# EasyEDA Pro project ProDocument_LN_CTRL_V1_2026-03-25.epro, board PCB1
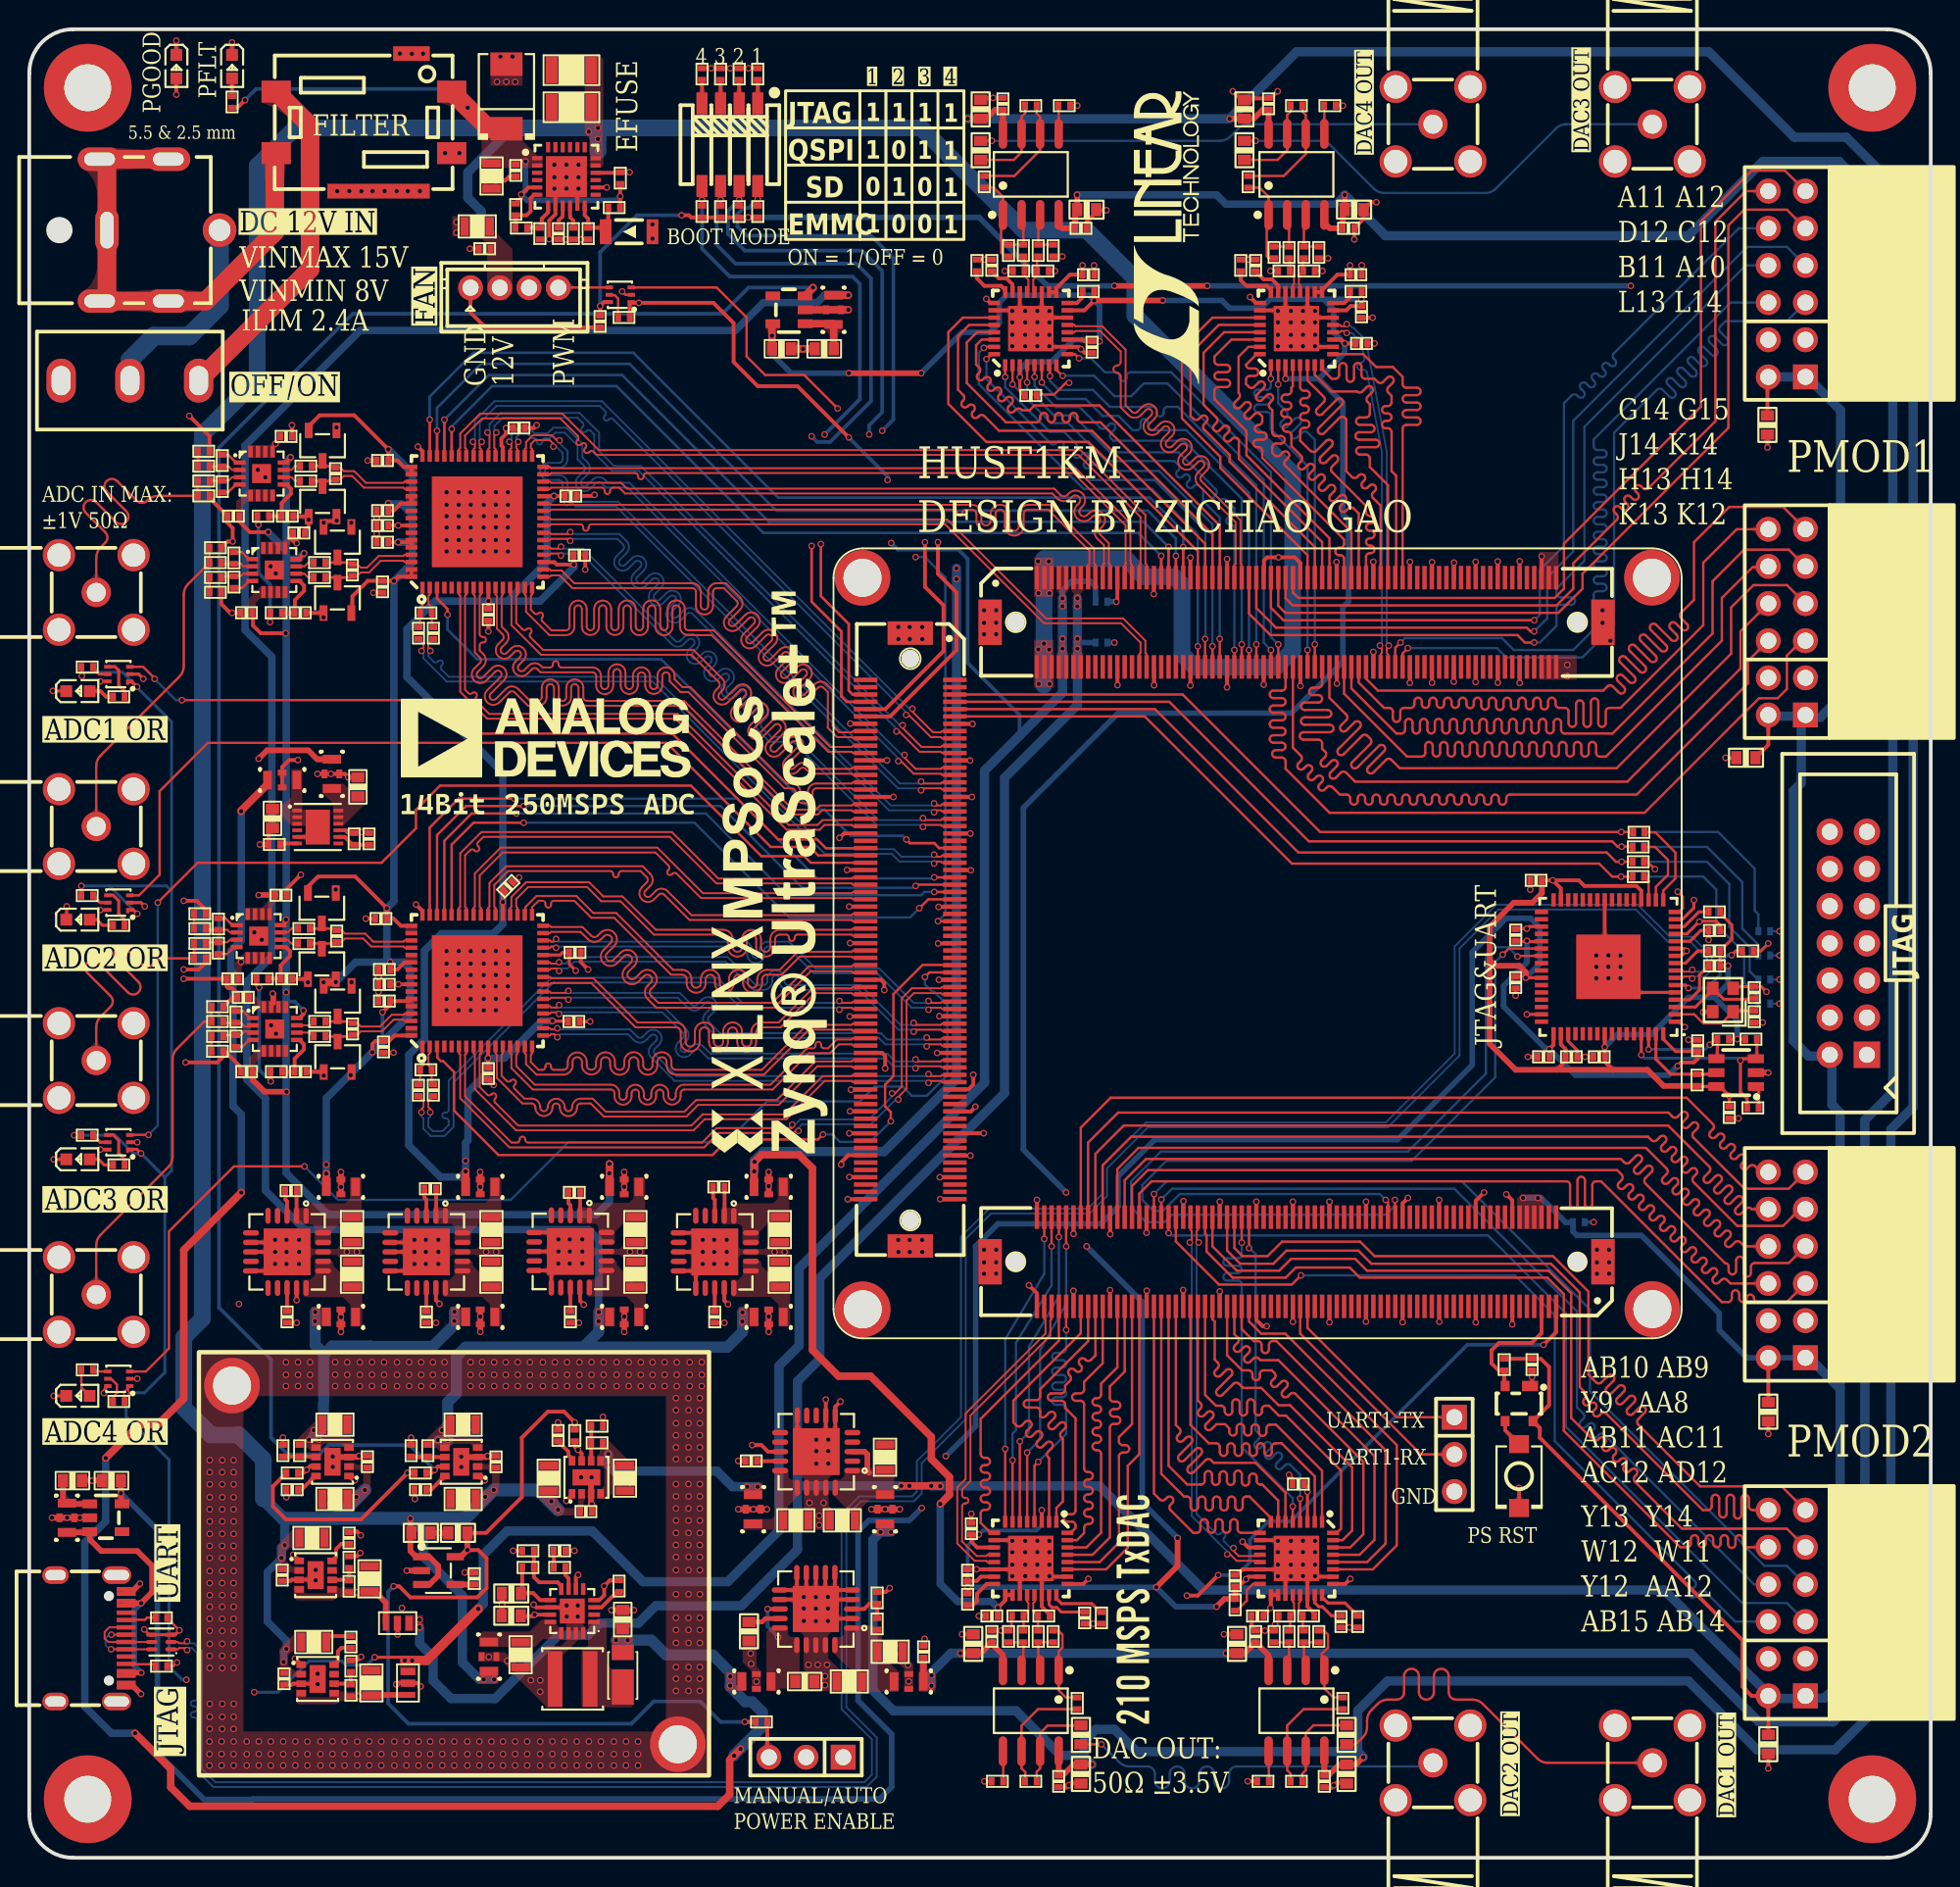
[diagram p5: board, top side]
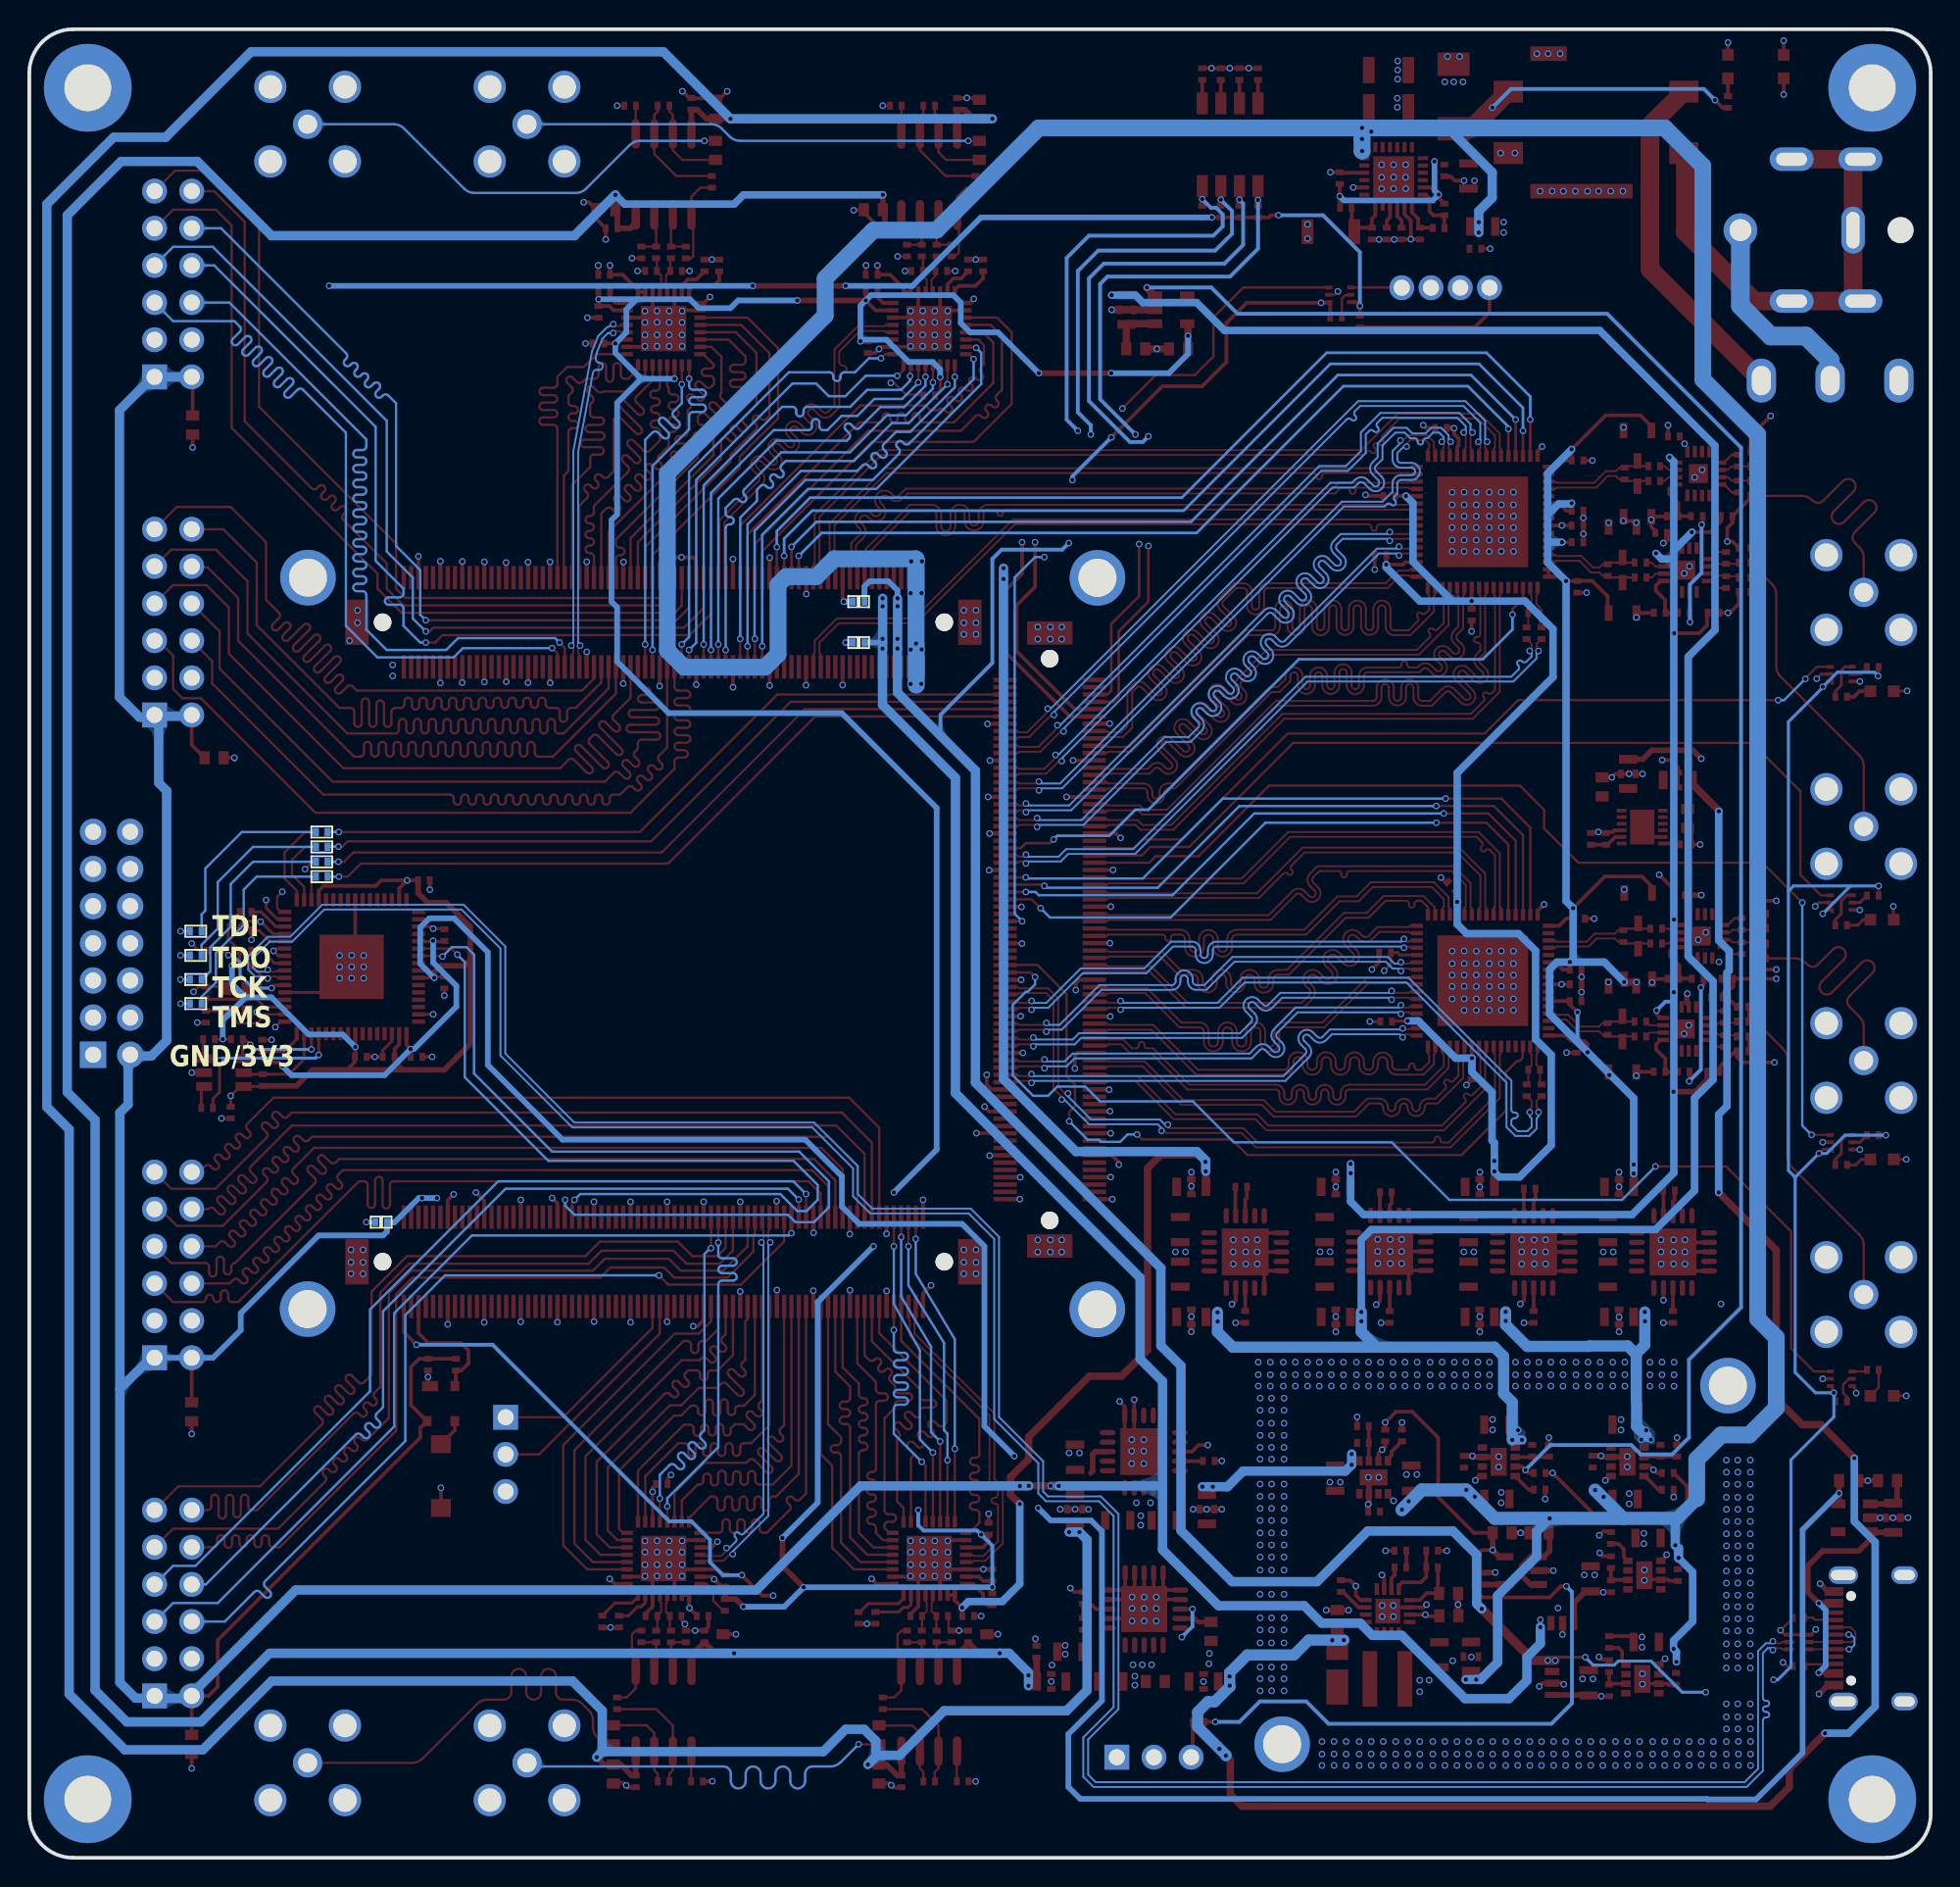
[diagram p6: board, bottom side, seen from below]

Outline 130 x 125 mm; copper layers: Top Layer, Inner1, Inner2, Bottom Layer. Coordinates in mm from the lower left corner of the outline.
Outline path: 0,122 0,3 arc(0.88,0.88) 3,0 127,0 arc(129.12,0.88) 130,3 130,122 arc(129.12,124.12) 127,125 3,125 arc(0.88,124.12) 0,122
Stack: Top Layer 0.035mm 外层铜厚1oz / Dielectric1 0.2104mm 7628 RC49% 8.6mil / Inner1 0.0152mm 内层铜厚 / Dielectric2 1.065mm 1.1mm H/HOZ 含铜 / Inner2 0.0152mm 内层铜厚 / Dielectric3 0.2104mm 7628 RC49% 8.6mil / Bottom Layer 0.035mm 外层铜厚1oz

## Design rules (mm)
net DAC1_IOUTA: DP12
net DAC1_IOUTB: DP12
net DAC2_IOUTA: DP11
net DAC2_IOUTB: DP11
net DAC3_IOUTA: DP14
net DAC3_IOUTB: DP14
net DAC4_IOUTA: DP13
net DAC4_IOUTB: DP13
net $4N2889: DP3
net $4N2892: DP3
net $4N2900: DP4
net ADC1_CHA_P: ADC1_CHA
net $4N2899: DP4
net ADC1_CHA_N: ADC1_CHA
net $4N5945: DP5
net $4N5946: DP5
net $4N5950: DP6
net ADC1_CHB_P: ADC1_CHB
net $4N5949: DP6
net ADC1_CHB_N: ADC1_CHB
net ADC1_CLK_P: ADC1_CLK
net $4N6204: DP1
net ADC1_CLK_N: ADC1_CLK
net $4N6213: DP1
net ADC2_CLK_P: ADC2_CLK
net $4N7666: DP2
net $4N7670: DP2
net $4N10596: DP9
net $4N10597: DP9
net $4N10601: DP10
net ADC2_CHA_P: ADC2_CHA
net $4N10600: DP10
net ADC2_CHA_N: ADC2_CHA
net $4N10616: DP7
net $4N10617: DP7
net $4N10621: DP8
net ADC2_CHB_P: ADC2_CHB
net $4N10620: DP8
net ADC2_CHB_N: ADC2_CHB
net ADC1_ORB_N: ADC1_ORB
net ADC1_ORB_P: ADC1_ORB
net ADC1_DCO_N: ADC1_DCO
net ADC1_DCO_P: ADC1_DCO
net ADC1_ORA_P: ADC1_ORA
net ADC1_ORA_N: ADC1_ORA
net ADC2_ORB_N: ADC2_ORB
net ADC2_ORB_P: ADC2_ORB
net ADC2_DCO_N: ADC2_DCO
net ADC2_DCO_P: ADC2_DCO
net ADC2_ORA_P: ADC2_ORA
net ADC2_ORA_N: ADC2_ORA
net B66_L15_P: B66_L15
net B66_L16_N: B66_L16
net B66_L16_P: B66_L16
net B66_L5_N: B66_L5
net B66_L14_P: B66_L14
net B66_L15_N: B66_L15
net B66_L5_P: B66_L5
net B66_L14_N: B66_L14
net B66_L1_P: B66_L1
net B66_L1_N: B66_L1
net B66_L2_P: B66_L2
net B66_L2_N: B66_L2
net B66_L20_P: B66_L20
net B66_L20_N: B66_L20
net B66_L17_P: B66_L17
net B66_L17_N: B66_L17
net B66_L19_N: B66_L19
net B66_L19_P: B66_L19
net B66_L18_P: B66_L18
net B66_L24_P: B66_L24
net B66_L18_N: B66_L18
net B66_L24_N: B66_L24
net B44_L3_P: B44_L3
net B44_L1_P: B44_L1
net B44_L9_P: B44_L9
net B44_L5_N: B44_L5
net B44_L8_N: B44_L8
net B44_L2_N: B44_L2
net B44_L11_P: B44_L11
net B44_L4_P: B44_L4
net B44_L5_P: B44_L5
net B44_L11_N: B44_L11
net B44_L4_N: B44_L4
net B44_L7_P: B44_L7
net B44_L1_N: B44_L1
net B44_L6_N: B44_L6
net B44_L10_N: B44_L10
net B44_L2_P: B44_L2
net B44_L6_P: B44_L6
net B44_L9_N: B44_L9
net B44_L3_N: B44_L3
net B44_L10_P: B44_L10
net B44_L7_N: B44_L7
net B44_L8_P: B44_L8
net B65_L7_N: B65_L7
net B65_L7_P: B65_L7
net B65_L16_P: B65_L16
net B65_L17_P: B65_L17
net B65_L17_N: B65_L17
net B65_L16_N: B65_L16
net B65_L23_P: B65_L23
net B65_L23_N: B65_L23
net B65_L10_N: B65_L10
net B65_L10_P: B65_L10
net B65_L8_P: B65_L8
net B65_L8_N: B65_L8
net B65_L19_N: B65_L19
net B65_L9_P: B65_L9
net B65_L11_N: B65_L11
net B65_L11_P: B65_L11
net B65_L9_N: B65_L9
net B65_L19_P: B65_L19
net B65_L18_N: B65_L18
net B65_L20_N: B65_L20
net B65_L20_P: B65_L20
net B65_L18_P: B65_L18
net B66_L6_N: B66_L6
net B66_L8_P: B66_L8
net B66_L8_N: B66_L8
net B66_L9_N: B66_L9
net B66_L7_P: B66_L7
net B66_L7_N: B66_L7
net B66_L9_P: B66_L9
net B66_L11_N: B66_L11
net B66_L11_P: B66_L11
net B66_L6_P: B66_L6
net B43_L9_N: B43_L9
net B43_L4_N: B43_L4
net B43_L6_N: B43_L6
net B43_L5_P: B43_L5
net B43_L11_P: B43_L11
net B43_L3_N: B43_L3
net B43_L8_N: B43_L8
net B43_L10_P: B43_L10
net B43_L4_P: B43_L4
net B43_L2_P: B43_L2
net B43_L8_P: B43_L8
net B43_L7_N: B43_L7
net B43_L1_N: B43_L1
net B43_L10_N: B43_L10
net B43_L5_N: B43_L5
net B43_L2_N: B43_L2
net B43_L9_P: B43_L9
net B43_L1_P: B43_L1
net B43_L12_P: B43_L12
net B43_L7_P: B43_L7
net B43_L3_P: B43_L3
net B43_L12_N: B43_L12
net B43_L11_N: B43_L11
net B43_L6_P: B43_L6
net B66_L10_P: B66_L10
net B66_L10_N: B66_L10
net 505_RX2_P: 505_RX2
net 505_RX3_N: 505_RX3
net 505_RX2_N: 505_RX2
net 505_CLK2_N: 505_CLK2
net 505_RX3_P: 505_RX3
net B45_L9_N: B45_L9
net B45_L8_P: B45_L8
net B45_L8_N: B45_L8
net B45_L10_P: B45_L10
net 505_CLK2_P: 505_CLK2
net B45_L10_N: B45_L10
net B45_L9_P: B45_L9
net B65_L3_N: B65_L3
net B65_L4_P: B65_L4
net B65_L6_N: B65_L6
net B65_L2_P: B65_L2
net B65_L1_N: B65_L1
net B65_L5_P: B65_L5
net B65_L1_P: B65_L1
net B65_L4_N: B65_L4
net B65_L5_N: B65_L5
net B65_L2_N: B65_L2
net B65_L3_P: B65_L3
net GT224_RX0_P: GT224_RX0
net GT224_TX0_P: GT224_TX0
net GT224_RX2_N: GT224_RX2
net GT224_TX2_N: GT224_TX2
net GT224_RX1_N: GT224_RX1
net GT224_TX3_N: GT224_TX3
net GT224_CLK0_P: GT224_CLK0
net GT224_TX1_N: GT224_TX1
net GT224_RX3_N: GT224_RX3
net GT224_CLK1_N: GT224_CLK1
net GT224_TX1_P: GT224_TX1
net GT224_CLK0_N: GT224_CLK0
net GT224_TX2_P: GT224_TX2
net GT224_CLK1_P: GT224_CLK1
net GT224_RX1_P: GT224_RX1
net GT224_RX2_P: GT224_RX2
net B65_L6_P: B65_L6
net GT224_RX3_P: GT224_RX3
net GT224_RX0_N: GT224_RX0
net GT224_TX3_P: GT224_TX3
net GT224_TX0_N: GT224_TX0
net B46_L5_N: B46_L5
net B46_L11_N: B46_L11
net B46_L3_P: B46_L3
net 505_CLK3_N: 505_CLK3
net B46_L1_P: B46_L1
net B46_L8_N: B46_L8
net 505_CLK0_P: 505_CLK0
net B46_L3_N: B46_L3
net B46_L8_P: B46_L8
net 505_CLK0_N: 505_CLK0
net B46_L12_N: B46_L12
net B46_L5_P: B46_L5
net 505_TX3_P: 505_TX3
net B46_L2_P: B46_L2
net B46_L9_P: B46_L9
net B46_L1_N: B46_L1
net B46_L2_N: B46_L2
net B46_L11_P: B46_L11
net 505_TX0_P: 505_TX0
net B46_L9_N: B46_L9
net B46_L12_P: B46_L12
net 505_RX1_P: 505_RX1
net 505_RX1_N: 505_RX1
net 505_TX1_P: 505_TX1
net 505_RX0_P: 505_RX0
net 505_CLK1_P: 505_CLK1
net 505_TX1_N: 505_TX1
net 505_TX2_N: 505_TX2
net 505_RX0_N: 505_RX0
net 505_TX2_P: 505_TX2
net B45_L11_N: B45_L11
net B45_L11_P: B45_L11
net B45_L5_N: B45_L5
net B46_L4_N: B46_L4
net 505_CLK3_P: 505_CLK3
net B45_L1_N: B45_L1
net B45_L1_P: B45_L1
net B45_L4_N: B45_L4
net B45_L3_N: B45_L3
net B45_L4_P: B45_L4
net B46_L7_N: B46_L7
net B45_L7_P: B45_L7
net B45_L2_P: B45_L2
net B46_L10_N: B46_L10
net B46_L10_P: B46_L10
net B45_L7_N: B45_L7
net B45_L2_N: B45_L2
net B45_L3_P: B45_L3
net B46_L7_P: B46_L7
net B45_L6_N: B45_L6
net B45_L6_P: B45_L6
net B46_L6_P: B46_L6
net B45_L5_P: B45_L5
net B45_L12_N: B45_L12
net B45_L12_P: B45_L12
net B46_L4_P: B46_L4
net B46_L6_N: B46_L6
net 505_TX3_N: 505_TX3
net 505_CLK1_N: 505_CLK1
net 505_TX0_N: 505_TX0
net ADC2_CLK_N: ADC2_CLK
net USB_DP: DP16
net USB_DN: DP16
net USB_DP_O: DP17
net USB_DN_O: DP17
template: 自定义配置
spacing copperThickness1oz (default): track to track 0.102, other pairs 0.152 to 0.3
spacing copperThickness2oz: track to track 0.203, other pairs 0.152 to 0.3
track width copperThickness1oz (default): min 0.127, default 0.157, max 2.54
track width copperThickness2oz: min 0.203, default 0.254, max 2.54
differential pair differentialPair (default): width min 0.127, default 0.127, max 2.54; gap min 0.203, default 0.203
via viaSize (default): diameter min 0.45, default 0.45, max 10; hole min 0.3, default 0.3, max 6.299
net ADC1_DCO_N uses ADC1_DB
net ADC1_DCO_P uses ADC1_DB
net ADC2_DCO_N uses ADC2_DB
net ADC2_DCO_P uses ADC2_DB
net B66_L15_P uses ADC1_DB
net B66_L16_N uses ADC1_DB
net B66_L16_P uses ADC1_DB
net B66_L5_N uses ADC1_DB
net B66_L14_P uses ADC1_DB
net B66_L15_N uses ADC1_DB
net B66_L5_P uses ADC1_DB
net B66_L14_N uses ADC1_DB
net B66_L1_P uses ADC1_DB
net B66_L1_N uses ADC1_DB
net B66_L2_P uses ADC1_DB
net B66_L2_N uses ADC1_DB
net B66_L20_P uses ADC1_DB
net B66_L20_N uses ADC1_DB
net B66_L19_N uses ADC1_DB
net B66_L19_P uses ADC1_DB
net B44_L3_P uses DAC1_DB
net B44_L1_P uses DAC1_DB
net B44_L9_P uses DAC1_DB
net B44_L5_N uses DAC1_DB
net B44_L8_N uses PMOD2
net B44_L2_N uses DAC1_DB
net B44_L11_P uses PMOD2
net B44_L4_P uses DAC1_DB
net B44_L12_P uses PMOD2
net B44_L5_P uses DAC1_DB
net B44_L11_N uses PMOD2
net B44_L4_N uses DAC1_DB
net B44_L7_P uses DAC1_DB
net B44_L1_N uses DAC1_DB
net B44_L12_N uses PMOD2
net B44_L6_N uses DAC1_DB
net B44_L10_N uses PMOD2
net B44_L2_P uses DAC1_DB
net B44_L6_P uses DAC1_DB
net B44_L9_N uses DAC1_DB
net B44_L3_N uses DAC1_DB
net B44_L10_P uses PMOD2
net B44_L7_N uses DAC1_DB
net B44_L8_P uses PMOD2
net B65_L7_N uses ADC2_DB
net B65_L7_P uses ADC2_DB
net B65_L16_P uses ADC2_DB
net B65_L17_P uses ADC2_DB
net B65_L17_N uses ADC2_DB
net B65_L16_N uses ADC2_DB
net B65_L10_N uses ADC2_DB
net B65_L10_P uses ADC2_DB
net B65_L8_P uses ADC2_DB
net B65_L8_N uses ADC2_DB
net B65_L19_N uses ADC2_DB
net B65_L9_P uses ADC2_DB
net B65_L11_N uses ADC2_DB
net B65_L11_P uses ADC2_DB
net B65_L9_N uses ADC2_DB
net B65_L19_P uses ADC2_DB
net B66_L6_N uses ADC1_DB
net B66_L8_P uses ADC1_DB
net B66_L8_N uses ADC1_DB
net B66_L9_N uses ADC1_DB
net B66_L7_P uses ADC1_DB
net B66_L7_N uses ADC1_DB
net B66_L9_P uses ADC1_DB
net B66_L11_N uses ADC1_DB
net B66_L11_P uses ADC1_DB
net B66_L6_P uses ADC1_DB
net B43_L9_N uses DAC2_DB
net B43_L4_N uses DAC2_DB
net B43_L6_N uses PMOD2
net B43_L5_P uses DAC2_DB
net B43_L11_P uses PMOD2
net B43_L3_N uses DAC2_DB
net B43_L8_N uses PMOD2
net B43_L10_P uses DAC2_DB
net B43_L4_P uses DAC2_DB
net B43_L2_P uses DAC2_DB
net B43_L8_P uses PMOD2
net B43_L7_N uses DAC2_DB
net B43_L1_N uses DAC2_DB
net B43_L10_N uses DAC2_DB
net B43_L5_N uses DAC2_DB
net B43_L2_N uses DAC2_DB
net B43_L9_P uses DAC2_DB
net B43_L1_P uses DAC2_DB
net B43_L12_P uses PMOD2
net B43_L7_P uses DAC2_DB
net B43_L3_P uses DAC2_DB
net B43_L12_N uses PMOD2
net B43_L11_N uses PMOD2
net B43_L6_P uses PMOD2
net B66_L10_P uses ADC1_DB
net B66_L10_N uses ADC1_DB
net B45_L9_N uses DAC4_DB
net B45_L8_P uses DAC4_DB
net B45_L8_N uses DAC4_DB
net B45_L10_P uses PMOD1
net B45_L10_N uses PMOD1
net B45_L9_P uses DAC4_DB
net B65_L3_N uses ADC2_DB
net B65_L4_P uses ADC2_DB
net B65_L6_N uses ADC2_DB
net B65_L2_P uses ADC2_DB
net B65_L1_N uses ADC2_DB
net B65_L5_P uses ADC2_DB
net B65_L1_P uses ADC2_DB
net B65_L4_N uses ADC2_DB
net B65_L5_N uses ADC2_DB
net B65_L2_N uses ADC2_DB
net B65_L3_P uses ADC2_DB
net B65_L6_P uses ADC2_DB
net B46_L5_N uses DAC3_DB
net B46_L11_N uses PMOD1
net B46_L3_P uses DAC3_DB
net B46_L1_P uses DAC3_DB
net B46_L8_N uses DAC3_DB
net B46_L3_N uses DAC3_DB
net B46_L8_P uses DAC3_DB
net B46_L12_N uses PMOD1
net B46_L5_P uses DAC3_DB
net B46_L2_P uses DAC3_DB
net B46_L9_P uses PMOD1
net B46_L1_N uses DAC3_DB
net B46_L2_N uses DAC3_DB
net B46_L11_P uses PMOD1
net B46_L9_N uses PMOD1
net B46_L12_P uses PMOD1
net B45_L11_N uses PMOD1
net B45_L11_P uses PMOD1
net B45_L5_N uses DAC4_DB
net B46_L4_N uses DAC3_DB
net B45_L1_N uses DAC4_DB
net B45_L1_P uses DAC4_DB
net B45_L4_N uses DAC4_DB
net B45_L3_N uses DAC4_DB
net B45_L4_P uses DAC4_DB
net B46_L7_N uses DAC3_DB
net B45_L7_P uses DAC4_DB
net B45_L2_P uses PMOD1
net B46_L10_N uses PMOD1
net B46_L10_P uses PMOD1
net B45_L7_N uses DAC4_DB
net B45_L2_N uses PMOD1
net B45_L3_P uses DAC4_DB
net B46_L7_P uses DAC3_DB
net B45_L6_N uses DAC4_DB
net B45_L6_P uses DAC4_DB
net B46_L6_P uses DAC3_DB
net B45_L5_P uses DAC4_DB
net B45_L12_N uses PMOD1
net B45_L12_P uses PMOD1
net B46_L4_P uses DAC3_DB
net B46_L6_N uses DAC3_DB
eq len grp ADC1_DB uses ADC1_DB
eq len grp ADC2_DB uses ADC2_DB
eq len grp DAC1_DB uses DAC1_DB
eq len grp PMOD2 uses PMOD2
eq len grp DAC2_DB uses DAC2_DB
eq len grp DAC4_DB uses DAC4_DB
eq len grp PMOD1 uses PMOD1
eq len grp DAC3_DB uses DAC3_DB

## Placement (name value [footprint] x y rotation side)
C1  100nF  [C0402]  102.74 33.71 90 top
C2  100nF  [C0402]  103.02 66.82 0 top
C3  100nF  [C0402]  107.34 54.75 0 top
C4  100nF  [C0402]  101.62 59.83 90 top
C5  100nF  [C0402]  116.23 50.94 90 top
C6  4.7uF  [C0402]  103.53 54.75 180 top
C7  100nF  [C0402]  105.43 54.75 180 top
C8  100nF  [C0402]  114.07 55.52 270 top
C9  100nF  [C0402]  101.62 63.08 270 top
C10  100nF  [C0402]  115.21 63.39 180 top
C12  12pF  [C0402]  117.94 59.15 270 top
C13  12pF  [C0402]  117.94 57.5 90 top
C14  10uF  [C0603#2]  2.95 25.78 0 top
C15  10uF  [C0603#2]  5.62 25.78 0 top
C16  100nF  [C0402]  31.14 110 0 top
C17  100nF  [C0402]  39.03 105.03 90 top
C18  10uF  [C0805]  30.63 111.52 0 top
C19  100nF  [C0402]  105.94 43.45 180 bottom
C20  100nF  [C0402]  73.3 83.07 180 bottom
C21  100nF  [C0402]  73.3 85.87 180 bottom
C22  1uF  [C0603]  118.89 7.76 90 top
C23  1uF  [C0603]  118.89 30.5 90 top
C24  1uF  [C0603]  117.37 75.2 0 top
C25  1uF  [C0603]  118.83 97.95 90 top
C26  100nF  [C0402]  89.68 16.15 270 top
C27  100nF  [C0402]  72.16 16.4 270 top
C28  100nF  [C0402]  65.81 108.85 90 top
C29  100nF  [C0402]  83.84 108.85 90 top
C30  100nF  [C0402]  65.81 16.53 0 top
C31  100nF  [C0402]  83.97 16.53 0 top
C32  100nF  [C0402]  72.41 108.22 180 top
C33  100nF  [C0402]  90.7 108.22 180 top
C34  100nF  [C0402]  64.16 19.32 270 top
C35  100nF  [C0402]  82.44 18.94 270 top
C36  100nF  [C0402]  68.47 99.97 180 top
C37  100nF  [C0402]  91.08 105.68 90 top
C38  100nF  [C0402]  64.41 22.5 270 top
C39  100nF  [C0402]  86.76 25.54 0 top
C40  100nF  [C0402]  72.67 103.27 90 top
C41  100nF  [C0402]  91.08 103.52 180 top
C42  1uF  [C0603]  71.9 5.73 90 top
C43  1uF  [C0603]  90.06 5.73 90 top
C44  1uF  [C0603]  65.05 119.52 270 top
C45  1uF  [C0603]  83.08 119.52 270 top
C46  100nF  [C0402]  70.38 5.22 90 top
C47  100nF  [C0402]  88.54 5.22 90 top
C48  100nF  [C0402]  66.57 119.9 270 top
C49  100nF  [C0402]  84.73 119.9 270 top
C50  1uF  [C0603]  72.28 112.66 180 top
C51  1uF  [C0603]  82.57 14.62 270 top
C52  1uF  [C0603]  64.54 14.62 270 top
C53  1uF  [C0603]  90.57 112.66 180 top
C54  100nF  [C0402]  71.9 111.4 180 top
C55  100nF  [C0402]  83.84 15.13 270 top
C56  100nF  [C0402]  65.81 15.13 270 top
C57  100nF  [C0402]  90.19 111.4 180 top
C58  22pF  [C0402]  20.94 94.63 90 top
C59  22pF  [C0402]  21.02 63.01 90 top
C60  100nF  [C0402]  17.64 91.72 0 top
C61  100nF  [C0402]  17.59 60.09 0 top
C62  22pF  [C0402]  22.09 88.03 90 top
C63  22pF  [C0402]  22.1 56.66 90 top
C64  100nF  [C0402]  18.53 85.11 0 top
C65  100nF  [C0402]  18.54 53.74 0 top
C66  100nF  [C0402]  26.61 83.71 270 top
C67  100nF  [C0402]  27.63 83.71 270 top
C68  100nF  [C0402]  13.96 91.72 0 top
C69  100nF  [C0402]  14.85 85.11 0 top
C70  100nF  [C0402]  14.86 53.74 0 top
C71  100nF  [C0402]  13.91 60.09 0 top
C72  100nF  [C0402]  24.15 91.08 180 top
C73  100nF  [C0402]  26.61 52.47 270 top
C74  100nF  [C0402]  24.28 59.71 180 top
C75  100nF  [C0402]  27.62 52.47 270 top
C76  100nF  [C0402]  24.28 58.56 0 top
C77  100nF  [C0402]  24.15 86.88 90 top
C78  100nF  [C0402]  24.15 95.52 0 top
C79  100nF  [C0402]  24.15 92.09 0 top
C80  100nF  [C0402]  33.49 97.74 180 top
C81  100nF  [C0402]  31.39 84.98 90 top
C82  100nF  [C0402]  37.03 93.09 180 top
C83  100nF  [C0402]  37.61 89.04 180 top
C84  100nF  [C0402]  24.22 55.43 90 top
C85  100nF  [C0402]  24.05 64.2 0 top
C86  100nF  [C0402]  24.28 60.72 0 top
C87  100nF  [C0402]  24.15 89.93 0 top
C88  100nF  [C0402]  31.39 53.61 90 top
C89  100nF  [C0402]  37.23 57.17 180 top
C90  100nF  [C0402]  37.31 61.89 180 top
C91  100nF  [C0402]  32.75 66.42 225 top
C92  3.3nF  [C0402]  17.98 25.16 180 top
C93  3.3nF  [C0402]  26.74 25.16 180 top
C94  3.3nF  [C0402]  36.15 28.87 90 top
C95  22uF  [C0805]  20.9 24.53 0 top
C96  1uF  [C0402]  23.12 27.08 90 top
C97  22uF  [C0805]  29.66 24.53 0 top
C98  22uF  [C0805]  35.52 25.95 270 top
C99  1uF  [C0402]  38.06 23.66 0 top
C100  1uF  [C0402]  31.91 27.07 90 top
C101  1uF  [C0603]  32.96 18.07 180 top
C102  22uF  [C0805]  33.59 13.88 90 top
C103  22uF  [C0805]  20.9 29.61 180 top
C104  22uF  [C0805]  29.66 29.61 180 top
C105  22uF  [C0805]  40.72 25.95 90 top
C106  1uF  [C0603]  32.96 16.54 0 top
C107  10uF  [C0603#2]  40.58 16.29 270 top
C108  22nF  [C0402]  36.26 20.99 180 top
C109  22uF  [C0805]  31.6 39.89 270 top
C110  22uF  [C0805]  31.6 42.94 270 top
C111  22uF  [C0805]  41.44 39.89 270 top
C112  22uF  [C0805]  41.44 42.94 270 top
C113  22uF  [C0805]  52.41 23.06 0 top
C114  22uF  [C0805]  58.5 27.38 270 top
C115  22uF  [C0805]  55.58 23.06 0 top
C116  10nF  [C0402]  27.15 36.97 90 top
C117  10nF  [C0402]  27.42 45.74 0 top
C118  10nF  [C0402]  36.99 36.97 90 top
C119  10nF  [C0402]  37.26 45.48 0 top
C120  100nF  [C0402]  49.36 27.13 0 top
C121  10uF  [C0603#2]  53.02 12.05 180 top
C122  22uF  [C0805]  56.06 12.05 180 top
C123  22uF  [C0805]  58.86 14.08 0 top
C124  100pF  [C0402]  61.14 14.08 270 top
C125  1uF  [C0603]  49.21 15.48 90 top
C126  10uF  [C0603]  29.31 22.21 0 top
C127  22uF  [C0805]  22.07 39.89 270 top
C128  22uF  [C0805]  22.07 42.94 270 top
C129  22uF  [C0805]  51.31 39.89 270 top
C130  22uF  [C0805]  51.31 42.94 270 top
C131  10uF  [C0603]  26.77 22.21 180 top
C132  100nF  [C0402]  30.42 19.08 270 top
C133  10nF  [C0402]  17.63 36.97 90 top
C134  10nF  [C0402]  17.9 45.61 0 top
C135  10nF  [C0402]  46.87 36.97 90 top
C136  10nF  [C0402]  47.14 45.86 0 top
C137  10uF  [C0603#2]  54.35 103.15 180 top
C138  10uF  [C0603#2]  51.43 103.15 180 top
C139  22uF  [C1206]  37.07 119.67 180 top
C140  3.3nF  [C0402]  21.99 14.75 90 top
C141  22uF  [C1206]  37.07 122.21 180 top
C142  10uF  [C0805]  31.61 114.97 90 top
C143  22uF  [C0805]  19.45 14.75 180 top
C144  1uF  [C0402]  17.42 12.23 270 top
C145  100nF  [C0402]  33.26 115.35 90 top
C146  22uF  [C0805]  23.39 11.95 270 top
C147  22nF  [C0402]  36.18 111.03 270 top
C148  3.3nF  [C0402]  21.87 21.86 90 top
C149  22uF  [C0805]  19.33 21.86 180 top
C150  1uF  [C0402]  17.29 19.32 270 top
C151  22uF  [C0805]  23.26 19.07 270 top
C152  100nF  [C0402]  17.21 65.8 180 top
C153  100nF  [C0402]  14.63 58.82 0 top
C154  100nF  [C0402]  17.56 97.17 180 top
C155  100nF  [C0402]  18.44 90.57 180 top
C156  10uF  [C0603#2]  16.63 71.05 90 top
C157  10uF  [C0603#2]  22.47 73.21 270 top
C158  4.7uF  [C0402]  23.23 69.65 270 top
CN1  Z-231011814106  [IDC-TH_14P-P2.54-V-R2-C7-S2.54]  124.37 62.51 90 top
CN2  WAFER-PH2.0-4PZZ  [CONN-TH_4P-P2.00_FWF20001-S04S22W5B]  33.17 107.33 0 top
D1  NSVR351SDSA3T1G  [SC-59-3_L2.9-W1.5-P0.95-LS2.5-BR]  20.05 96.53 90 top
D2  NSVR351SDSA3T1G  [SC-59-3_L2.9-W1.5-P0.95-LS2.5-BR]  20 64.91 90 top
D3  NSVR351SDSA3T1G  [SC-59-3_L2.9-W1.5-P0.95-LS2.5-BR]  20.05 92.72 270 top
D4  NSVR351SDSA3T1G  [SC-59-3_L2.9-W1.5-P0.95-LS2.5-BR]  20 61.1 270 top
D5  NSVR351SDSA3T1G  [SC-59-3_L2.9-W1.5-P0.95-LS2.5-BR]  21.07 89.94 90 top
D6  NSVR351SDSA3T1G  [SC-59-3_L2.9-W1.5-P0.95-LS2.5-BR]  21.08 58.56 90 top
D7  NSVR351SDSA3T1G  [SC-59-3_L2.9-W1.5-P0.95-LS2.5-BR]  21.07 86.13 270 top
D8  NSVR351SDSA3T1G  [SC-59-3_L2.9-W1.5-P0.95-LS2.5-BR]  21.08 54.75 270 top
D9  SMBJ20A  [SMB_L4.5-W3.7-LS5.4-RD]  32.62 120.56 90 top
D10  ZMM3V6  [LL-34_L3.5-W1.5-RD]  41.01 111.16 0 top
DC1  DC-042Z-10A-2.5  [DC-IN-TH_DC-042C-Z-2.5-A]  8.91 111.27 0 top
H1  X6511WV-03H-C60D30  [HDR-TH_3P-P2.54-V-M]  97.43 27.57 270 top
H2  X6511WV-03H-C60D30  [HDR-TH_3P-P2.54-V-M]  53.11 6.87 180 top
L1  BLM15PD121SN1D  [L0402]  115.21 60.98 180 top
L2  BLM15PD121SN1D  [L0402]  115.21 61.99 180 top
L3  NFM21PC104R1E3D  [CAP-SMD_4P-L2.0-W1.25]  2.57 23.24 270 top
L4  ECMF02-2AMX6  [UFQFN-6_L1.7-W1.5]  9.04 14.75 180 top
L5  NFM21PC104R1E3D  [CAP-SMD_4P-L2.0-W1.25]  31.43 13.75 270 top
L6  NFM21PC104R1E3D  [CAP-SMD_4P-L2.0-W1.25]  30.83 36.97 180 top
L7  NFM21PC104R1E3D  [CAP-SMD_4P-L2.0-W1.25]  30.83 45.86 0 top
L8  NFM21PC104R1E3D  [CAP-SMD_4P-L2.0-W1.25]  40.68 36.97 180 top
L9  NFM21PC104R1E3D  [CAP-SMD_4P-L2.0-W1.25]  40.68 45.86 0 top
L10  NFM21PC104R1E3D  [CAP-SMD_4P-L2.0-W1.25]  49.49 23.82 90 top
L11  NFM21PC104R1E3D  [CAP-SMD_4P-L2.0-W1.25]  58.5 23.82 90 top
L12  NFM21PC104R1E3D  [CAP-SMD_4P-L2.0-W1.25]  49.71 12.05 0 top
L13  NFM21PC104R1E3D  [CAP-SMD_4P-L2.0-W1.25]  60.13 12.05 0 top
L14  NFM21PC104R1E3D  [CAP-SMD_4P-L2.0-W1.25]  21.31 36.97 180 top
L15  NFM21PC104R1E3D  [CAP-SMD_4P-L2.0-W1.25]  21.31 45.86 0 top
L16  NFM21PC104R1E3D  [CAP-SMD_4P-L2.0-W1.25]  50.55 36.97 180 top
L17  NFM21PC104R1E3D  [CAP-SMD_4P-L2.0-W1.25]  50.55 45.86 0 top
L18  NFM21PC104R1E3D  [CAP-SMD_4P-L2.0-W1.25]  54.98 105.82 90 top
L19  10uF  [FILTER-SMD_BNX026H01L]  22.88 118.63 0 top
L20  NFM18PC105R0J3D  [FILTER-SMD_3P-L1.6-W0.8-L]  25.89 11.93 90 top
L21  NFM18PC105R0J3D  [FILTER-SMD_3P-L1.6-W0.8-L]  25.17 16.03 0 top
L22  NFM21PC104R1E3D  [CAP-SMD_4P-L2.0-W1.25]  17.29 73.68 0 top
L23  NFM21PC104R1E3D  [CAP-SMD_4P-L2.0-W1.25]  20.69 74.1 90 top
LED1  NCD0603C1  [LED0603-RD]  10.05 122.44 270 top
NOREF  -  [Pad_e2072]  110.97 37.51 0 top
NOREF#2  -  [Pad_e7182]  126 4 180 top
NOREF#3  -  [Pad_e7183]  126 121 180 top
NOREF#4  -  [Pad_e5586]  13.86 32.27 0 top
NOREF#5  -  [Pad_e5588]  44.34 7.76 0 top
NOREF#6  -  [Pad_e2071]  110.94 87.51 0 top
NOREF#7  -  [Pad_e2073]  56.98 37.49 0 top
NOREF#8  -  [Pad_e2070]  56.97 87.5 0 top
NOREF#9  -  [Pad_e7151]  4 121 180 top
NOREF#10  -  [Pad_e7165]  4 4 180 top
R1  4.7kΩ  [R0402]  49.8 112.54 270 top
R2  4.7kΩ  [R0402]  48.54 112.54 270 top
R3  4.7kΩ  [R0402]  47.27 112.54 270 top
R4  4.7kΩ  [R0402]  45.99 112.54 270 top
R5  330Ω  [R0402]  49.8 121.94 270 top
R6  330Ω  [R0402]  48.54 121.94 270 top
R7  330Ω  [R0402]  47.27 121.94 270 top
R8  330Ω  [R0402]  45.99 121.94 270 top
R9  10K  [R0402]  115.81 55.96 180 top
R10  10K  [R0402]  114.03 53.17 90 top
R11  4.7kΩ  [R0402]  100.84 33.71 90 top
R12  12K  [R0402]  117.5 61.99 180 top
R13  1K  [R0402]  115.21 64.66 180 top
R21  33Ω  [R0402]  118.62 58.39 180 bottom
R22  2K  [R0402]  117.84 51.26 0 top
R23  33Ω  [R0402]  118.62 60.04 180 bottom
R24  33Ω  [R0402]  118.62 61.69 180 bottom
R25  10K  [R0402]  117.71 55.96 180 top
R26  33Ω  [R0402]  118.62 63.34 180 bottom
R27  5.1K  [R0402]  9.04 13.1 180 top
R28  5.1K  [R0402]  9.04 16.4 180 top
R29  10kΩ  [R0402]  50.06 9.29 180 top
R30  0Ω  [R0402]  110.05 70.1 180 top
R31  10K  [R0402]  40.66 105.3 180 top
R32  NC  [R0402]  110 70.12 180 bottom
R33  10K  [R0402]  3.96 81.4 0 top
R34  0Ω  [R0402]  110 69.1 180 top
R35  NC  [R0402]  110 69.1 180 bottom
R36  4.7kΩ  [R0402]  6.12 79.37 0 top
R37  0Ω  [R0402]  110 68.09 180 top
R38  NC  [R0402]  110 68.09 180 bottom
R39  10K  [R0402]  3.96 65.78 0 top
R40  0Ω  [R0402]  110 67.07 180 top
R41  NC  [R0402]  110 67.07 180 bottom
R42  4.7kΩ  [R0402]  6.12 63.75 0 top
R43  10K  [R0402]  3.96 49.39 0 top
R44  4.7kΩ  [R0402]  6.12 47.36 0 top
R45  10K  [R0402]  6.12 31.19 180 top
R46  4.7kΩ  [R0402]  3.96 33.35 0 top
R47  2kΩ  [R0402]  90.83 16.15 270 top
R48  2kΩ  [R0402]  73.3 16.4 270 top
R49  10kΩ  [R0402]  82.44 17.29 90 top
R50  470  [R0402]  88.16 15.13 270 top
R51  10kΩ  [R0402]  64.16 17.67 90 top
R52  27  [R0402]  87.46 16.53 0 top
R53  820  [R0402]  86.64 5.22 180 top
R54  220  [R0402]  87.14 15.13 90 top
R55  220  [R0402]  89.81 10.56 90 top
R56  220  [R0402]  86.13 15.13 90 top
R57  49.9  [R0603]  90.06 8.4 270 top
R58  27  [R0402]  85.81 16.53 0 top
R59  470  [R0402]  85.11 15.13 90 top
R60  180  [R0402]  84.35 5.22 180 top
R61  470  [R0402]  70 15.13 270 top
R62  27  [R0402]  69.36 16.53 0 top
R63  820  [R0402]  68.47 5.22 180 top
R64  220  [R0402]  68.98 15.13 90 top
R65  220  [R0402]  71.65 10.56 90 top
R66  2kΩ  [R0402]  82.83 108.85 90 top
R67  2kΩ  [R0402]  64.79 108.85 90 top
R68  220  [R0402]  67.97 15.13 90 top
R69  49.9  [R0603]  71.9 8.4 270 top
R70  10kΩ  [R0402]  72.41 107.08 0 top
R71  27  [R0402]  67.58 16.53 0 top
R72  470  [R0402]  66.95 15.13 90 top
R73  180  [R0402]  66.19 5.22 180 top
R74  10kΩ  [R0402]  90.7 107.08 0 top
R75  470  [R0402]  85.11 109.74 90 top
R76  27  [R0402]  85.78 108.47 180 top
R77  820  [R0402]  86.64 119.78 0 top
R78  220  [R0402]  86.13 109.74 270 top
R79  220  [R0402]  83.33 114.57 270 top
R80  49.9  [R0603]  83.08 116.73 90 top
R81  220  [R0402]  87.14 109.74 270 top
R82  27  [R0402]  87.49 108.47 180 top
R83  470  [R0402]  88.16 109.74 270 top
R84  180  [R0402]  88.92 119.78 0 top
R85  470  [R0402]  66.95 109.87 90 top
R86  27  [R0402]  67.65 108.47 180 top
R87  820  [R0402]  68.47 119.78 0 top
R88  220  [R0402]  67.97 109.87 270 top
R89  220  [R0402]  65.3 114.57 270 top
R90  220  [R0402]  68.98 109.87 270 top
R91  49.9  [R0603]  65.05 116.73 90 top
R92  27  [R0402]  69.3 108.47 180 top
R93  470  [R0402]  70 109.87 270 top
R94  180  [R0402]  70.76 119.78 0 top
R95  26.7Ω  [R0402]  11.92 96.15 180 top
R96  26.7Ω  [R0402]  11.66 64.53 0 top
R97  499Ω  [R0402]  13.19 95.52 90 top
R98  499Ω  [R0402]  12.93 63.83 90 top
R99  240Ω  [R0402]  11.92 94.12 0 top
R100  240Ω  [R0402]  11.92 95.13 0 top
R101  240Ω  [R0402]  11.66 62.5 0 top
R102  240Ω  [R0402]  11.66 63.52 0 top
R103  57.6Ω  [R0402]  11.92 93.1 0 top
R104  499Ω  [R0402]  13.19 93.74 270 top
R105  33Ω  [R0402]  18.91 95.13 180 top
R106  57.6Ω  [R0402]  11.66 61.48 180 top
R107  499Ω  [R0402]  12.93 62.18 270 top
R108  33Ω  [R0402]  18.77 63.52 180 top
R109  33Ω  [R0402]  18.91 94.12 180 top
R110  33Ω  [R0402]  18.77 62.5 180 top
R111  33Ω  [R0402]  15.99 91.72 180 top
R112  33Ω  [R0402]  15.94 60.09 180 top
R113  57.6Ω  [R0402]  12.73 89.56 0 top
R114  57.6Ω  [R0402]  12.87 58.18 0 top
R115  499Ω  [R0402]  14 88.86 90 top
R116  240Ω  [R0402]  12.73 87.52 0 top
R117  240Ω  [R0402]  12.73 88.54 0 top
R118  240Ω  [R0402]  12.87 57.17 0 top
R119  499Ω  [R0402]  14.14 57.48 90 top
R120  26.7Ω  [R0402]  12.73 86.51 180 top
R121  499Ω  [R0402]  14 87.21 270 top
R122  240Ω  [R0402]  12.87 56.15 0 top
R123  33Ω  [R0402]  19.84 88.54 180 top
R124  26.7Ω  [R0402]  12.87 55.13 180 top
R125  499Ω  [R0402]  14.14 55.83 270 top
R126  33Ω  [R0402]  19.85 57.17 180 top
R127  33Ω  [R0402]  19.84 87.52 180 top
R128  33Ω  [R0402]  19.85 56.15 180 top
R129  33Ω  [R0402]  16.88 85.11 180 top
R130  33Ω  [R0402]  16.89 53.74 180 top
R131  100Ω  [R0402]  27.12 85.1 180 top
R132  100Ω  [R0402]  27.12 53.87 180 top
R133  10K  [R0402]  17.98 26.31 0 top
R134  10K  [R0402]  26.74 26.31 0 top
R135  10K  [R0402]  37.3 28.87 270 top
R136  91K  [R0402]  17.34 27.83 90 top
R137  36K  [R0402]  26.11 27.83 90 top
R138  36K  [R0402]  38.82 29.5 0 top
R139  150K  [R0402]  18.48 27.83 270 top
R140  130K  [R0402]  27.25 27.83 270 top
R141  210kΩ  [R0402]  38.82 28.36 180 top
R142  140kΩ  [R0402]  34.1 19.84 180 top
R143  1.1MΩ  [R0402]  34.1 20.99 180 top
R144  1MΩ  [R0402]  40.32 18.57 90 top
R145  2.2kΩ  [R0402]  36.26 19.84 0 top
R146  332kΩ  [R0402]  57.97 15.99 270 top
R147  102kΩ  [R0402]  57.97 17.76 90 top
R148  91K  [R0402]  21.99 13.1 90 top
R149  4.7kΩ  [R0402]  40.41 114.82 270 top
R150  120K  [R0402]  21.99 11.45 90 top
R151  511kΩ  [R0402]  33.26 112.68 90 top
R152  51.1kΩ  [R0402]  33.64 111.41 180 top
R153  20kΩ  [R0402]  39.99 112.81 0 top
R154  47kΩ  [R0402]  34.91 111.03 270 top
R155  6.65kΩ  [R0402]  38.21 111.03 90 top
R156  7.5kΩ  [R0402]  37.2 111.03 270 top
R157  24K  [R0402]  21.87 20.21 90 top
R158  75K  [R0402]  21.87 18.56 90 top
R159  4.7kΩ  [R0402]  13.86 120.03 270 top
R160  7.5kΩ  [R0402]  16.75 69.27 0 top
R161  33.2kΩ  [R0402]  22.21 69.65 270 top
SW1  GT-TC029B-H025-L1N  [SW-SMD_L3.9-W3.0-P4.45]  101.85 26.09 270 top
SW2  SS-12D10L5  [SW-TH_SS-12D10L5]  6.88 100.98 0 top
U1  FT2232HQ-REEL  [QFN-64_L9.0-W9.0-P0.50-TL-EP4.3]  107.96 60.91 180 top
U2  DSHP04TJGET  [SW-SMD_8P-L6.7-W5.4-P1.27-LS5.6]  47.9 117.11 180 top
U3  HX811T  [SOT-143_L2.9-W1.3-P1.92-LS2.3-BL]  101.85 31.05 180 top
U4  93LC56BT-I/OT  [SOT-23-6_L2.9-W1.6-P0.95-LS2.8-BR]  116.7 53.67 0 top
U5  TPS7A2033PDBVR  [SOT-23-5_L2.9-W1.6-P0.95-LS2.8-BR]  5.24 23.24 180 top
U6  PM254-2-06-W-8.5  [HDR-TH_12P-P2.54-H-F-R2-C6-W8.5]  120.16 40.53 90 top
U7  PM254-2-06-W-8.5  [HDR-TH_12P-P2.54-H-F-R2-C6-W8.5]  120.16 107.58 90 top
U8  PM254-2-06-W-8.5  [HDR-TH_12P-P2.54-H-F-R2-C6-W8.5]  120.16 17.41 90 top
U9  PM254-2-06-W-8.5  [HDR-TH_12P-P2.54-H-F-R2-C6-W8.5]  120.16 84.47 90 top
U10  SN74LVC1T45DPKR  [USON-6_L1.6-W1.6-P0.50-BL]  40.41 106.82 90 top
U11  SN74LVC1T45DPKR  [USON-6_L1.6-W1.6-P0.50-BL]  6.12 80.89 90 top
U12  NCD0603R6  [LED0603-RD]  3.33 79.75 0 top
U13  SN74LVC1T45DPKR  [USON-6_L1.6-W1.6-P0.50-BL]  6.12 65.27 90 top
U14  NCD0603R6  [LED0603-RD]  3.33 64.13 0 top
U15  SN74LVC1T45DPKR  [USON-6_L1.6-W1.6-P0.50-BL]  6.12 48.89 90 top
U16  NCD0603R6  [LED0603-RD]  3.33 47.74 0 top
U17  SN74LVC1T45DPKR  [USON-6_L1.6-W1.6-P0.50-BL]  6.12 32.72 90 top
U18  NCD0603R6  [LED0603-RD]  3.33 31.58 0 top
U19  -  [MOLEX_SMA]  110.97 6.5 270 top
U20  -  [MOLEX_SMA]  95.97 6.5 270 top
U21  -  [MOLEX_SMA]  110.97 118.5 90 top
U22  -  [MOLEX_SMA]  95.97 118.5 90 top
U23  ADA4932-1YCPZ-R2  [LFCSP-16_L3.0-W3.0-P0.50-BL-EP1.3]  15.89 94.63 270 top
U24  ADA4932-1YCPZ-R2  [LFCSP-16_L3.0-W3.0-P0.50-BL-EP1.3]  15.69 63.01 270 top
U25  -  [MOLEX_SMA]  4.59 86.5 180 top
U26  -  [MOLEX_SMA]  4.59 54.5 180 top
U27  ADA4932-1YCPZ-R2  [LFCSP-16_L3.0-W3.0-P0.50-BL-EP1.3]  16.75 88.03 270 top
U28  ADA4932-1YCPZ-R2  [LFCSP-16_L3.0-W3.0-P0.50-BL-EP1.3]  16.79 56.66 270 top
U29  -  [MOLEX_SMA]  4.59 70.5 180 top
U30  -  [MOLEX_SMA]  4.59 38.5 180 top
U31  TPS82130SILR  [USIP-8_L3.0-W2.8-P0.65-TL-EP]  20.73 27.07 180 top
U32  TPS82130SILR  [USIP-8_L3.0-W2.8-P0.65-TL-EP]  29.54 27.07 180 top
U33  TPS82130SILR  [USIP-8_L3.0-W2.8-P0.65-TL-EP]  38.09 26 90 top
U34  ADP5074ACPZ-R7  [LFCSP-16_L3.0-W3.0-P0.50-BL-EP1.7]  37.12 16.87 90 top
U35  DFLS240L  [POWERDI-123_L2.8-W1.8-LS3.7-RD]  40.58 12.86 90 top
U36  XAL4020-222MEC  [IND-SMD_L4.0-W4.0-A]  37.15 12.22 180 top
U37  TPS7A8300ARGWR  [VQFN-20_L5.0-W5.0-P0.65-TL-EP3.2]  27.15 41.42 270 top
U38  TPS7A8300ARGWR  [VQFN-20_L5.0-W5.0-P0.65-TL-EP3.2]  36.99 41.45 270 top
U39  TPS7A4701MRGWREP  [VQFN-20_L5.0-W5.0-P0.65-TL-EP3.2]  53.81 27.76 180 top
U40  TPS7A3301RGWR  [VQFN-20_L5.0-W5.0-P0.65-TL-EP]  53.78 17 180 top
U41  SPX3819M5-L-5-0/TR  [SOT-23-5_L3.0-W1.7-P0.95-LS2.8-BL]  27.97 19.63 270 top
U42  TPS7A8300ARGWR  [VQFN-20_L5.0-W5.0-P0.65-TL-EP3.2]  17.63 41.42 270 top
U43  TPS7A8300ARGWR  [VQFN-20_L5.0-W5.0-P0.65-TL-EP3.2]  46.87 41.42 270 top
U44  TPS7A2033PDBVR  [SOT-23-5_L2.9-W1.6-P0.95-LS2.8-BR]  51.94 105.82 0 top
U45  TPS82130SILR  [USIP-8_L3.0-W2.8-P0.65-TL-EP]  19.72 12.22 0 top
U46  TPS16630RGER  [VFQFPN-24_L4.0-W4.0-P0.50-BL-EP2.8]  36.72 114.94 270 top
U47  TPS82130SILR  [USIP-8_L3.0-W2.8-P0.65-TL-EP]  19.58 19.32 0 top
U48  NCD0603R6  [LED0603-RD]  13.86 122.44 270 top
U49  AD9744ACPZ  [LFCSP-32_L5.0-W5.0-P0.50-TL-EP3.1]  86.64 20.46 270 top
U50  AD9744ACPZ  [LFCSP-32_L5.0-W5.0-P0.50-TL-EP3.1]  68.47 20.46 270 top
U51  AD9744ACPZ  [LFCSP-32_L5.0-W5.0-P0.50-TL-EP3.1]  86.64 104.54 90 top
U52  AD9744ACPZ  [LFCSP-32_L5.0-W5.0-P0.50-TL-EP3.1]  68.47 104.54 90 top
U53  LT1819IS8#PBF  [SOP-8_L5.0-W4.0-P1.27-LS6.0-BL]  86.64 10.05 180 top
U54  LT1819IS8#PBF  [SOP-8_L5.0-W4.0-P1.27-LS6.0-BL]  68.47 10.05 180 top
U55  LT1819IS8#PBF  [SOP-8_L5.0-W4.0-P1.27-LS6.0-BL]  86.64 115.08 0 top
U56  LT1819IS8#PBF  [SOP-8_L5.0-W4.0-P1.27-LS6.0-BL]  68.47 115.08 0 top
U57  AD9643BCPZ-250  [LFCSP-64_L9.0-W9.0-P0.50-BL-EP6.2]  30.63 91.33 0 top
U58  AD9643BCPZ-250  [LFCSP-64_L9.0-W9.0-P0.50-BL-EP6.2]  30.63 59.96 0 top
U59  LT3094IDD#TRPBF  [DFN-12_L3.0-W3.0-P0.45-BL-EP-1]  19.73 70.46 270 top
UCN1  -  [FX10A-144S-SV]  86.64 40.74 180 top
UCN2  -  [FX10A-144S-SV]  60.23 62.77 270 top
UCN3  -  [FX10A-144S-SV]  86.64 84.46 0 top
USB1  typec  [USB-C-SMD_KH-TYPE-C-16P]  4.21 15 270 top
X1  12MHz  [OSC-SMD_4P-L2.5-W2.0-BL]  115.78 58.64 90 top

## Footprints (pads in the part's own frame, mm; a bottom-side part is the same pattern mirrored in y, then rotated)
C0402
  rect 0.4x0.55 smd: 1(-0.4,0) 2(0.4,0)
C0603
  rect 0.7x0.9 smd: 1(-0.657,-0.002) 2(0.642,-0.002)
C0603#2
  rect 0.7x0.9 smd: 1(-0.65,0) 2(0.65,0)
C0805
  rect 0.559x1.27 smd: 1(-0.86,0) 2(0.86,0)
C1206
  rect 0.8x1.8 smd: 1(-1.35,0) 2(1.35,0)
CAP-SMD_4P-L2.0-W1.25
  rect 0.6x1.25 smd: 1(-1,0) 3(1,0)
  rect 0.6x0.4 smd: 2(0,-0.508) 4(0,0.508)
CONN-TH_4P-P2.00_FWF20001-S04S22W5B
  round 1.7 hole 1.1: 1(-3,0) 2(-1,0) 3(1,0) 4(3,0)
DC-IN-TH_DC-042C-Z-2.5-A
  oval 3x1.6 hole 2.1x0.9: 1(-4.1,4.85) 1(-4.1,-4.85) 1(0.6,4.85) 1(0.6,-4.85)
  oval 1.6x3.2 hole 0.9x2.5: 2(-3.6,0)
  round 2.3 hole 1.5: 3(4.1,0)
DFN-12_L3.0-W3.0-P0.45-BL-EP-1
  rect 0.252x0.665 smd: 1(-1.125,-1.407) 2(-0.675,-1.407) 3(-0.225,-1.407) 4(0.225,-1.407) 5(0.675,-1.407) 6(1.125,-1.407) 7(1.125,1.407) 8(0.675,1.407) 9(0.225,1.407) 10(-0.225,1.407) 11(-0.675,1.407) 12(-1.125,1.407)
  rect 2.38x1.65 smd: 13(0,0)
FILTER-SMD_3P-L1.6-W0.8-L
  rect 0.4x1 smd: 1(-0.8,0)
  rect 0.5x1 smd: 2(0,0) 3(0.8,0)
FILTER-SMD_BNX026H01L
  rect 2x1.5 smd: 1(-6,2.1) 2(6,2.1) 3(-6,-2.1) 4(6,-2.1)
  rect 7x1 smd: 4(1,-4.7)
  rect 2.5x1 smd: 4(3.25,4.7)
FX10A-144S-SV
  rect 0.3x1.6 smd: 1(-17.75,3.05) 2(-17.75,-3.05) 3(-17.25,3.05) 4(-17.25,-3.05) 5(-16.75,3.05) 6(-16.75,-3.05) 7(-16.25,3.05) 8(-16.25,-3.05) 9(-15.75,3.05) 10(-15.75,-3.05) 11(-15.25,3.05) 12(-15.25,-3.05) 13(-14.75,3.05) 14(-14.75,-3.05) 15(-14.25,3.05) 16(-14.25,-3.05) 17(-13.75,3.05) 18(-13.75,-3.05) 19(-13.25,3.05) 20(-13.25,-3.05) 21(-12.75,3.05) 22(-12.75,-3.05) 23(-12.25,3.05) 24(-12.25,-3.05) 25(-11.75,3.05) 26(-11.75,-3.05) 27(-11.25,3.05) 28(-11.25,-3.05) 29(-10.75,3.05) 30(-10.75,-3.05) 31(-10.25,3.05) 32(-10.25,-3.05) 33(-9.75,3.05) 34(-9.75,-3.05) 35(-9.25,3.05) 36(-9.25,-3.05) 37(-8.75,3.05) 38(-8.75,-3.05) 39(-8.25,3.05) 40(-8.25,-3.05) 41(-7.75,3.05) 42(-7.75,-3.05) 43(-7.25,3.05) 44(-7.25,-3.05) 45(-6.75,3.05) 46(-6.75,-3.05) 47(-6.25,3.05) 48(-6.25,-3.05) 49(-5.75,3.05) 50(-5.75,-3.05) 51(-5.25,3.05) 52(-5.25,-3.05) 53(-4.75,3.05) 54(-4.75,-3.05) 55(-4.25,3.05) 56(-4.25,-3.05) 57(-3.75,3.05) 58(-3.75,-3.05) 59(-3.25,3.05) 60(-3.25,-3.05) 61(-2.75,3.05) 62(-2.75,-3.05) 63(-2.25,3.05) 64(-2.25,-3.05) 65(-1.75,3.05) 66(-1.75,-3.05) 67(-1.25,3.05) 68(-1.25,-3.05) 69(-0.75,3.05) 70(-0.75,-3.05) 71(-0.25,3.05) 72(-0.25,-3.05) 73(0.25,3.05) 74(0.25,-3.05) 75(0.75,3.05) 76(0.75,-3.05) 77(1.25,3.05) 78(1.25,-3.05) 79(1.75,3.05) 80(1.75,-3.05) 81(2.25,3.05) 82(2.25,-3.05) 83(2.75,3.05) 84(2.75,-3.05) 85(3.25,3.05) 86(3.25,-3.05) 87(3.75,3.05) 88(3.75,-3.05) 89(4.25,3.05) 90(4.25,-3.05) 91(4.75,3.05) 92(4.75,-3.05) 93(5.25,3.05) 94(5.25,-3.05) 95(5.75,3.05) 96(5.75,-3.05) 97(6.25,3.05) 98(6.25,-3.05) 99(6.75,3.05) 100(6.75,-3.05) 101(7.25,3.05) 102(7.25,-3.05) 103(7.75,3.05) 104(7.75,-3.05) 105(8.25,3.05) 106(8.25,-3.05) 107(8.75,3.05) 108(8.75,-3.05) 109(9.25,3.05) 110(9.25,-3.05) 111(9.75,3.05) 112(9.75,-3.05) 113(10.25,3.05) 114(10.25,-3.05) 115(10.75,3.05) 116(10.75,-3.05) 117(11.25,3.05) 118(11.25,-3.05) 119(11.75,3.05) 120(11.75,-3.05) 121(12.25,3.05) 122(12.25,-3.05) 123(12.75,3.05) 124(12.75,-3.05) 125(13.25,3.05) 126(13.25,-3.05) 127(13.75,3.05) 128(13.75,-3.05) 129(14.25,3.05) 130(14.25,-3.05) 131(14.75,3.05) 132(14.75,-3.05) 133(15.25,3.05) 134(15.25,-3.05) 135(15.75,3.05) 136(15.75,-3.05) 137(16.25,3.05) 138(16.25,-3.05) 139(16.75,3.05) 140(16.75,-3.05) 141(17.25,3.05) 142(17.25,-3.05) 143(17.75,3.05) 144(17.75,-3.05)
  rect 1.6x3.1 smd: 145(20.95,0) 146(-20.95,0)
  round 1.2 hole 1.27: 147(-19.2,0) 148(19.2,0)
HDR-TH_3P-P2.54-V-M
  rect 1.7x1.7 hole 1.1: 1(-2.54,0)
  round 1.7 hole 1.1: 2(0,0) 3(2.54,0)
HDR-TH_12P-P2.54-H-F-R2-C6-W8.5
  rect 1.7x1.7 hole 1.1: 1(-6.35,-1.27)
  round 1.7 hole 1.1: 2(-6.35,1.27) 3(-3.81,-1.27) 4(-3.81,1.27) 5(-1.27,-1.27) 6(-1.27,1.27) 7(1.27,-1.27) 8(1.27,1.27) 9(3.81,-1.27) 10(3.81,1.27) 11(6.35,-1.27) 12(6.35,1.27)
IDC-TH_14P-P2.54-V-R2-C7-S2.54
  rect 1.8x1.8 hole 1.1: 1(-7.62,-1.27)
  round 1.8 hole 1.1: 2(-7.62,1.27) 3(-5.08,-1.27) 4(-5.08,1.27) 5(-2.54,-1.27) 6(-2.54,1.27) 7(0,-1.27) 8(0,1.27) 9(2.54,-1.27) 10(2.54,1.27) 11(5.08,-1.27) 12(5.08,1.27) 13(7.62,-1.27) 14(7.62,1.27)
IND-SMD_L4.0-W4.0-A
  rect 1x3.8 smd: 1(-1.2,0) 2(1.2,0)
L0402
  rect 0.4x0.55 smd: 1(-0.4,0) 2(0.4,0)
LED0603-RD
  rect 0.8x0.8 smd: 1(-0.799,0) 2(0.799,0)
LFCSP-16_L3.0-W3.0-P0.50-BL-EP1.3
  rect 0.3x0.8 smd: 1(-0.75,-1.5) 2(-0.25,-1.5) 3(0.25,-1.5) 4(0.75,-1.5) 9(0.75,1.5) 10(0.25,1.5) 11(-0.25,1.5) 12(-0.75,1.5)
  rect 0.8x0.3 smd: 5(1.5,-0.75) 6(1.5,-0.25) 7(1.5,0.25) 8(1.498,0.751) 13(-1.5,0.75) 14(-1.5,0.25) 15(-1.5,-0.25) 16(-1.5,-0.75)
  rect 1.3x1.3 smd: 17(0,0)
LFCSP-16_L3.0-W3.0-P0.50-BL-EP1.7
  rect 0.3x0.8 smd: 1(-0.75,-1.5) 2(-0.25,-1.5) 3(0.25,-1.5) 4(0.75,-1.5) 9(0.75,1.5) 10(0.25,1.5) 11(-0.25,1.5) 12(-0.75,1.5)
  rect 0.8x0.3 smd: 5(1.5,-0.75) 6(1.5,-0.25) 7(1.5,0.25) 8(1.498,0.751) 13(-1.5,0.75) 14(-1.5,0.25) 15(-1.5,-0.25) 16(-1.5,-0.75)
  rect 1.7x1.7 smd: 17(0,0)
LFCSP-32_L5.0-W5.0-P0.50-TL-EP3.1
  rect 0.8x0.3 smd: 1(-2.5,1.75) 2(-2.5,1.25) 3(-2.5,0.75) 4(-2.5,0.25) 5(-2.5,-0.25) 6(-2.5,-0.75) 7(-2.5,-1.25) 8(-2.5,-1.75) 17(2.5,-1.75) 18(2.5,-1.25) 19(2.5,-0.75) 20(2.5,-0.25) 21(2.5,0.25) 22(2.5,0.75) 23(2.5,1.25) 24(2.5,1.75)
  rect 0.299x0.8 smd: 9(-1.75,-2.5) 10(-1.25,-2.5) 11(-0.75,-2.5) 12(-0.25,-2.5) 13(0.25,-2.5) 14(0.75,-2.5) 15(1.25,-2.5) 16(1.75,-2.5) 25(1.75,2.5) 26(1.25,2.5) 27(0.75,2.5) 28(0.25,2.5) 29(-0.25,2.5) 30(-0.75,2.5) 31(-1.25,2.5) 32(-1.75,2.5)
  rect 3.1x3.1 smd: 33(0,0)
LFCSP-64_L9.0-W9.0-P0.50-BL-EP6.2
  rect 0.3x0.8 smd: 1(-3.75,-4.5) 2(-3.25,-4.5) 3(-2.75,-4.5) 4(-2.25,-4.5) 5(-1.75,-4.5) 6(-1.25,-4.5) 7(-0.75,-4.5) 8(-0.25,-4.5) 9(0.25,-4.5) 10(0.75,-4.5) 11(1.25,-4.5) 12(1.75,-4.5) 13(2.25,-4.5) 14(2.75,-4.5) 15(3.25,-4.5) 16(3.75,-4.5) 33(3.75,4.5) 34(3.25,4.5) 35(2.75,4.5) 36(2.25,4.5) 37(1.75,4.5) 38(1.25,4.5) 39(0.75,4.5) 40(0.25,4.5) 41(-0.25,4.5) 42(-0.75,4.5) 43(-1.25,4.5) 44(-1.75,4.5) 45(-2.25,4.5) 46(-2.75,4.5) 47(-3.25,4.5) 48(-3.75,4.5)
  rect 0.8x0.3 smd: 17(4.5,-3.75) 18(4.5,-3.25) 19(4.5,-2.75) 20(4.5,-2.25) 21(4.5,-1.75) 22(4.5,-1.25) 23(4.5,-0.75) 24(4.5,-0.25) 25(4.5,0.25) 26(4.5,0.75) 27(4.5,1.25) 28(4.5,1.75) 29(4.5,2.25) 30(4.5,2.75) 31(4.5,3.25) 32(4.5,3.75) 49(-4.5,3.75) 50(-4.5,3.25) 51(-4.5,2.75) 52(-4.5,2.25) 53(-4.5,1.75) 54(-4.5,1.25) 55(-4.5,0.75) 56(-4.5,0.25) 57(-4.5,-0.25) 58(-4.5,-0.75) 59(-4.5,-1.25) 60(-4.5,-1.75) 61(-4.5,-2.25) 62(-4.5,-2.75) 63(-4.5,-3.25) 64(-4.5,-3.75)
  rect 6.2x6.2 smd: 65(-0.002,-0.001)
LL-34_L3.5-W1.5-RD
  rect 0.8x1.7 smd: 1(-1.6,0) 2(1.6,0)
MOLEX_SMA
  round 2.2 hole 1.6: 1(-2.539,-2.55) 2(-2.539,2.55) 3(2.561,2.55) 4(2.561,-2.55)
  round 2 hole 1.3: 5(0.011,0)
OSC-SMD_4P-L2.5-W2.0-BL
  rect 0.9x0.8 smd: 1(-0.8,-0.715) 2(0.8,-0.715) 3(0.8,0.685) 4(-0.8,0.685)
Pad_e2070
  round 3.8 hole 2.6: 1(0,0)
Pad_e2071
  round 3.8 hole 2.6: 1(0,0)
Pad_e2072
  round 3.8 hole 2.6: 1(0,0)
Pad_e2073
  round 3.8 hole 2.6: 1(0,0)
Pad_e5586
  round 3.8 hole 2.6: 1(0,0)
Pad_e5588
  round 3.8 hole 2.6: 1(0,0)
Pad_e7151
  round 6 hole 3.2: 1(0,0)
Pad_e7165
  round 6 hole 3.2: 1(0,0)
Pad_e7182
  round 6 hole 3.2: 1(0,0)
Pad_e7183
  round 6 hole 3.2: 1(0,0)
POWERDI-123_L2.8-W1.8-LS3.7-RD
  rect 2.4x1.5 smd: 1(-1.188,0)
  rect 1.05x1.5 smd: 2(1.188,0)
QFN-64_L9.0-W9.0-P0.50-TL-EP4.3
  rect 0.9x0.3 smd: 1(-4.575,3.75) 2(-4.575,3.25) 3(-4.575,2.75) 4(-4.575,2.25) 5(-4.575,1.75) 6(-4.575,1.25) 7(-4.575,0.75) 8(-4.575,0.25) 9(-4.575,-0.25) 10(-4.575,-0.75) 11(-4.575,-1.25) 12(-4.575,-1.75) 13(-4.575,-2.25) 14(-4.575,-2.75) 15(-4.575,-3.25) 16(-4.575,-3.75) 33(4.575,-3.75) 34(4.575,-3.25) 35(4.575,-2.75) 36(4.575,-2.25) 37(4.575,-1.75) 38(4.575,-1.25) 39(4.575,-0.75) 40(4.575,-0.25) 41(4.575,0.25) 42(4.575,0.75) 43(4.575,1.25) 44(4.575,1.75) 45(4.575,2.25) 46(4.575,2.75) 47(4.575,3.25) 48(4.575,3.75)
  rect 0.3x0.9 smd: 17(-3.75,-4.575) 18(-3.25,-4.575) 19(-2.75,-4.575) 20(-2.25,-4.575) 21(-1.75,-4.575) 22(-1.25,-4.575) 23(-0.75,-4.575) 24(-0.25,-4.575) 25(0.25,-4.575) 26(0.75,-4.575) 27(1.25,-4.575) 28(1.75,-4.575) 29(2.25,-4.575) 30(2.75,-4.575) 31(3.25,-4.575) 32(3.75,-4.575) 49(3.75,4.575) 50(3.25,4.575) 51(2.75,4.575) 52(2.25,4.575) 53(1.75,4.575) 54(1.25,4.575) 55(0.75,4.575) 56(0.25,4.575) 57(-0.25,4.575) 58(-0.75,4.575) 59(-1.25,4.575) 60(-1.75,4.575) 61(-2.25,4.575) 62(-2.75,4.575) 63(-3.25,4.575) 64(-3.75,4.575)
  rect 4.4x4.4 smd: 65(0,-0.001)
R0402
  rect 0.4x0.55 smd: 1(-0.4,0) 2(0.4,0)
R0603
  rect 0.7x0.9 smd: 1(-0.657,-0.002) 2(0.642,-0.002)
SC-59-3_L2.9-W1.5-P0.95-LS2.5-BR
  rect 1.058x0.532 smd: 1(1.041,-0.95) 2(1.041,0.95) 3(-1.041,0)
SMB_L4.5-W3.7-LS5.4-RD
  rect 1.6x2.192 smd: 1(-2.361,0) 2(2.056,0)
SOP-8_L5.0-W4.0-P1.27-LS6.0-BL
  oval 0.574x2.035 smd: 1(-1.905,-2.768) 2(-0.635,-2.768) 3(0.635,-2.768) 4(1.905,-2.768) 5(1.905,2.768) 6(0.635,2.768) 7(-0.635,2.768) 8(-1.905,2.768)
SOT-23-5_L2.9-W1.6-P0.95-LS2.8-BR
  rect 1x0.6 smd: 1(1.1,-0.95) 2(1.1,0) 3(1.1,0.95) 4(-1.1,0.95) 5(-1.1,-0.95)
SOT-23-5_L3.0-W1.7-P0.95-LS2.8-BL
  rect 0.49x1.157 smd: 1(-0.95,-1.153) 2(0,-1.153) 3(0.95,-1.153)
  rect 0.49x1.175 smd: 4(0.95,1.153) 5(-0.95,1.153)
SOT-23-6_L2.9-W1.6-P0.95-LS2.8-BR
  rect 1.1x0.6 smd: 1(1.35,-0.95) 2(1.35,0) 3(1.35,0.95) 4(-1.35,0.95) 5(-1.35,0) 6(-1.35,-0.95)
SOT-143_L2.9-W1.3-P1.92-LS2.3-BL
  rect 1.1x0.7 smd: 1(-0.75,-1.2)
  rect 0.6x0.7 smd: 2(0.95,-1.2) 3(0.95,1.2) 4(-0.95,1.2)
SW-SMD_8P-L6.7-W5.4-P1.27-LS5.6
  rect 0.762x1.5 smd: 1(-1.905,-2.825) 2(-0.635,-2.825) 3(0.635,-2.825) 4(1.905,-2.825) 5(1.905,2.825) 6(0.635,2.825) 7(-0.635,2.825) 8(-1.905,2.825)
SW-SMD_L3.9-W3.0-P4.45
  rect 1.23x1.36 smd: 1(-2.185,0) 2(2.185,0)
SW-TH_SS-12D10L5
  oval 2x3 hole 1.3x2: 1(-4.7,0) 2(0,0) 3(4.7,0)
UFQFN-6_L1.7-W1.5
  oval 0.79x0.28 smd: 1(-0.657,0.5) 2(-0.657,0) 3(-0.657,-0.5) 4(0.657,-0.5) 5(0.657,0) 6(0.657,0.5)
USB-C-SMD_KH-TYPE-C-16P
  oval 1.2x2 hole 0.7x1.7: 1(-4.32,1.765) 2(4.32,1.765)
  oval 1.2x1.8 hole 0.7x1.4: 3(-4.32,-2.415) 4(4.32,-2.415)
  rect 0.3x1.3 smd: A1(-3.35,2.415) A4(-2.55,2.415) A5(-1.25,2.415) A6(-0.25,2.415) A7(0.25,2.415) A8(1.25,2.415) A9(2.55,2.415) A12(3.35,2.415) B1(3.05,2.415) B4(2.25,2.415) B5(1.75,2.415) B6(0.75,2.415) B7(-0.75,2.415) B8(-1.75,2.415) B9(-2.25,2.415) B12(-3.05,2.415)
USIP-8_L3.0-W2.8-P0.65-TL-EP
  rect 0.65x0.45 smd: 1(-1.125,0.975) 2(-1.125,0.325) 3(-1.125,-0.325) 4(-1.125,-0.975) 5(1.125,-0.975) 6(1.125,-0.325) 7(1.125,0.325) 8(1.125,0.975)
  rect 1.1x1.9 smd: 9(0,0)
USON-6_L1.6-W1.6-P0.50-BL
  custom 0.36x0.5 smd: 1(-0.525,-0.75)
  rect 0.26x0.5 smd: 2(0.025,-0.75) 3(0.525,-0.75) 4(0.525,0.75) 5(0.025,0.75) 6(-0.475,0.75)
VFQFPN-24_L4.0-W4.0-P0.50-BL-EP2.8
  rect 0.28x0.7 smd: 1(-1.25,-2) 2(-0.75,-2) 3(-0.25,-2) 4(0.25,-2) 5(0.75,-2) 6(1.25,-2) 13(1.25,2) 14(0.75,2) 15(0.25,2) 16(-0.25,2) 17(-0.75,2) 18(-1.242,2)
  rect 0.7x0.28 smd: 7(2,-1.25) 8(2,-0.75) 9(2,-0.25) 10(2,0.25) 11(2,0.75) 12(2,1.25) 19(-2,1.25) 20(-2,0.75) 21(-2,0.25) 22(-2,-0.25) 23(-2,-0.75) 24(-2,-1.25)
  rect 2.8x2.8 smd: 25(0.013,0)
VQFN-20_L5.0-W5.0-P0.65-TL-EP
  oval 1.087x0.364 smd: 1(-2.469,1.3) 2(-2.469,0.65) 3(-2.469,0) 4(-2.469,-0.65) 5(-2.469,-1.3) 11(2.469,-1.3) 12(2.469,-0.65) 13(2.469,0) 14(2.469,0.65) 15(2.469,1.3)
  oval 0.364x1.087 smd: 6(-1.3,-2.469) 7(-0.65,-2.469) 8(0,-2.469) 9(0.65,-2.469) 10(1.3,-2.469) 16(1.3,2.469) 17(0.65,2.469) 18(0,2.469) 19(-0.65,2.469) 20(-1.3,2.469)
  rect 3.15x3.15 smd: 21(0,0)
VQFN-20_L5.0-W5.0-P0.65-TL-EP3.2
  oval 1.087x0.364 smd: 1(-2.469,1.3) 2(-2.469,0.65) 3(-2.469,0) 4(-2.469,-0.65) 5(-2.469,-1.3) 11(2.469,-1.3) 12(2.469,-0.65) 13(2.469,0) 14(2.469,0.65) 15(2.469,1.3)
  oval 0.364x1.087 smd: 6(-1.3,-2.469) 7(-0.65,-2.469) 8(0,-2.469) 9(0.65,-2.469) 10(1.3,-2.469) 16(1.3,2.469) 17(0.65,2.469) 18(0,2.469) 19(-0.65,2.469) 20(-1.3,2.469)
  rect 3.2x3.2 smd: 21(0,0)

## Nets
As in the schematic, except:
GND: C1.1 C2.1 C3.1 C4.1 C5.1 C6.2 C7.1 C8.1 C9.1 C10.1 C12.1 C13.1 C14.2 C15.1 C16.1 C17.1 C18.1 C19.1 C20.1 C21.1 C22.1 C23.1 C24.1 C25.1 C26.2 C27.2 C28.2 C29.2 C30.1 C31.1 C32.1 C33.1 C34.1 C35.1 C36.1 C37.1 C38.1 C39.1 C40.1 C41.1 C42.1 C43.1 C44.1 C45.1 C46.1 C47.1 C48.1 C49.1 C50.1 C51.1 C52.1 C53.1 C54.1 C55.1 C56.1 C57.1 C60.2 C61.2 C64.2 C65.2 C68.1 C69.1 C70.1 C71.1 C72.2 C74.2 C76.1 C77.1 C78.1 C79.1 C80.1 C81.1 C82.1 C83.1 C84.1 C85.1 C86.1 C87.1 C88.1 C89.1 C90.1 C91.1 C92.2 C93.2 C94.2 C95.1 C96.2 C97.1 C98.1 C99.2 C100.2 C101.2 C102.1 C103.1 C104.1 C105.1 C106.1 C107.1 C108.1 C109.1 C110.2 C111.1 C112.2 C113.2 C114.1 C115.1 C116.1 C118.1 C120.1 C121.1 C122.2 C123.2 C124.1 C125.1 C126.1 C127.1 C128.2 C129.1 C130.2 C131.1 C132.1 C133.1 C135.1 C137.2 C138.1 C139.2 C140.2 C141.2 C142.1 C143.1 C144.2 C145.1 C146.1 C147.2 C148.2 C149.1 C150.2 C151.1 C152.1 C153.1 C154.1 C155.1 C156.1 C157.1 C158.1 CN1.1 CN1.3 CN1.5 CN1.7 CN1.9 CN1.11 CN1.13 CN2.1 D1.1 D2.1 D3.1 D4.1 D5.1 D6.1 D7.1 D8.1 D9.2 D10.2 H1.3 L3.2 L3.4 L4.3 L4.4 L5.2 L5.4 L6.2 L6.4 L7.2 L7.4 L8.2 L8.4 L9.2 L9.4 L10.2 L10.4 L11.2 L11.4 L12.2 L12.4 L13.2 L13.4 L14.2 L14.4 L15.2 L15.4 L16.2 L16.4 L17.2 L17.4 L18.2 L18.4 L19.4 L20.2 L21.2 L22.2 L22.4 L23.2 L23.4 LED1.1 NOREF.1 NOREF#2.1 NOREF#3.1 NOREF#4.1 NOREF#5.1 NOREF#6.1 NOREF#7.1 NOREF#8.1 NOREF#9.1 NOREF#10.1 R5.1 R6.1 R7.1 R8.1 R12.1 R27.1 R28.1 R47.2 R48.2 R52.2 R58.1 R59.2 R60.2 R62.2 R66.2 R67.2 R71.1 R72.2 R73.2 R76.2 R82.1 R83.2 R84.2 R86.2 R92.1 R93.2 R94.2 R95.1 R96.2 R103.2 R106.1 R113.2 R114.2 R120.1 R124.1 R136.2 R137.2 R138.2 R147.2 R148.2 R154.2 R155.1 R156.2 R157.2 R160.1 R161.1 SW1.2 U1.1 U1.5 U1.10 U1.11 U1.13 U1.15 U1.25 U1.35 U1.47 U1.51 U1.65 U3.1 U4.2 U5.2 U6.3 U6.4 U7.3 U7.4 U8.3 U8.4 U9.3 U9.4 U10.2 U11.2 U12.1 U13.2 U14.1 U15.2 U16.1 U17.2 U18.1 U19.1 U19.2 U19.3 U19.4 U20.1 U20.2 U20.3 U20.4 U21.1 U21.2 U21.3 U21.4 U22.1 U22.2 U22.3 U22.4 U23.17 U24.17 U25.1 U25.2 U25.3 U25.4 U26.1 U26.2 U26.3 U26.4 U27.17 U28.17 U29.1 U29.2 U29.3 U29.4 U30.1 U30.2 U30.3 U30.4 U31.3 U31.9 U32.3 U32.9 U33.3 U33.9 U34.10 U34.14 U34.15 U34.16 U34.17 U36.2 U37.7 U37.8 U37.10 U37.18 U37.21 U38.6 U38.8 U38.10 U38.11 U38.18 U38.21 U39.6 U39.7 U39.10 U39.17 U39.18 U39.19 U39.21 U40.2 U40.4 U40.5 U40.6 U40.7 U40.8 U40.9 U40.10 U40.11 U40.12 U40.17 U40.18 U40.19 U40.21 U41.2 U42.7 U42.8 U42.10 U42.18 U42.21 U43.6 U43.8 U43.10 U43.11 U43.18 U43.21 U44.2 U45.3 U45.9 U46.8 U46.11 U46.25 U47.3 U47.9 U49.10 U49.14 U49.19 U49.22 U49.25 U49.26 U49.33 U50.10 U50.14 U50.19 U50.22 U50.25 U50.26 U50.33 U51.10 U51.14 U51.19 U51.22 U51.25 U51.26 U51.33 U52.10 U52.14 U52.19 U52.22 U52.25 U52.26 U52.33 U57.48 U57.65 U58.48 U58.65 U59.9 UCN1.13 UCN1.14 UCN1.23 UCN1.24 UCN1.33 UCN1.34 UCN1.43 UCN1.44 UCN1.53 UCN1.54 UCN1.63 UCN1.64 UCN1.73 UCN1.74 UCN1.83 UCN1.84 UCN1.93 UCN1.94 UCN1.103 UCN1.104 UCN1.113 UCN1.114 UCN1.123 UCN1.124 UCN1.133 UCN1.134 UCN1.143 UCN1.144 UCN1.145 UCN1.146 UCN2.13 UCN2.14 UCN2.23 UCN2.24 UCN2.33 UCN2.34 UCN2.43 UCN2.44 UCN2.53 UCN2.54 UCN2.63 UCN2.64 UCN2.73 UCN2.74 UCN2.83 UCN2.84 UCN2.93 UCN2.94 UCN2.103 UCN2.104 UCN2.113 UCN2.114 UCN2.119 UCN2.120 UCN2.125 UCN2.126 UCN2.131 UCN2.132 UCN2.137 UCN2.138 UCN2.143 UCN2.144 UCN2.145 UCN2.146 UCN3.23 UCN3.24 UCN3.33 UCN3.34 UCN3.43 UCN3.44 UCN3.53 UCN3.54 UCN3.63 UCN3.64 UCN3.73 UCN3.74 UCN3.83 UCN3.84 UCN3.93 UCN3.94 UCN3.103 UCN3.104 UCN3.109 UCN3.110 UCN3.115 UCN3.116 UCN3.121 UCN3.122 UCN3.127 UCN3.128 UCN3.133 UCN3.134 UCN3.139 UCN3.140 UCN3.141 UCN3.142 UCN3.143 UCN3.144 UCN3.145 UCN3.146 USB1.1 USB1.2 USB1.3 USB1.4 USB1.A1 USB1.A12 USB1.B1 USB1.B12 X1.2 X1.4

Pads without a net: CN1 12 14; CN2 3; SW2 1; U1 21 22 23 24 26 27 28 29 30 32 33 34 36 40 41 43 44 45 46 48 52 53 54 55 57 58 59 60; U5 4; U34 2 5; U37 4 5 6 9 11 12; U38 4 5 7 9 12; U39 2 4 5 8 9 11 12; U42 4 5 6 9 11 12; U43 4 5 7 9 12; U44 4; U45 7; U46 3 4 13 15 19 20 21 22 23 24; U47 7; U57 4 5 55 56 58; U58 4 5 55 56 58; U59 4 7; UCN1 2 3 4 7 9 11 15 16 17 18 19 20 21 22 25 26 27 28 29 30 31 32 36 38 40 42 50 52 55 56 57 58 59 60 61 62 65 66 67 68 70 72 75 76 77 78 79 80 81 82 147 148; UCN2 1 2 3 4 46 147 148; UCN3 16 147 148; USB1 A8 B8

## Via types
v1: diameter 0.45, hole 0.299, Top Layer to Bottom Layer, 640 vias
v2: diameter 0.45, hole 0.3, Top Layer to Bottom Layer, 738 vias

## Routing (per net, layer and track width the routed paths; a pad name or vN(x,y) marks a point on that pad's centre or on a via; arc(x,y) is an arc through that point)
2V1: length 19.5
  Bottom Layer w0.762: 20.17,34.44 20.13,34.4 20.13,31.24 ; 20.17,34.44 20.19,34.42 ; 20.17,34.44 19.55,35.06 v1(19.55,37.31) ; 20.17,34.44 20.72,34.99 23.33,34.99 23.36,34.96 27.59,34.96 29.07,36.43 v1(29.07,37.32) ; 20.11,31.03 20.11,29.49 19.43,28.81
  vias: v1(19.45,29.23) v1(19.54,36.68) v1(29.06,36.69) v2(19.13,28.58) v2(19.79,28.58)
3V3: length 245.3
  Top Layer w0.203: U1.42 v1(102.31,60.16) 102.24,60.23 C4.2 ; C5.2 v1(116.23,52.09) 115.59,52.72 U4.6 114.07,52.72 R10.1 ; 115.62,62.02 116.4,62.8 116.4,63.77 115.69,64.48 ; R25.2 v1(116.77,55.96) R9.1 ; L2.1 L1.1 v1(116.14,60.98)
  Top Layer w0.254: v1(104.16,66.82) 105.94,66.82 106.32,66.44 109.88,66.44 110.21,66.1 U1.20 ; v1(104.16,66.82) C2.2 ; v1(104.16,66.82) 104.71,66.27 U1.31 ; U1.50 104.71,55.6 105.03,55.28 C7.2 105.03,54.46 104.43,53.86 ; 108.27,53.86 107.74,54.4 C3.2 107.71,54.78 v1(107.71,55.42) U1.56
  Top Layer w0.381: R10.1 111.74,52.77 110.64,53.86 101.62,53.86 99.84,55.64 99.84,61.36 ; U5.5 6.27,24.26 v1(6.27,24.91) C15.2 ; 99.84,61.36 100.22,60.98 101.88,60.98 102.31,60.54 v1(102.31,60.16) ; 99.84,61.36 99.84,63.64 101.49,65.29 102.76,65.29 103.42,65.95 C2.2
  Inner2 w0.381: v1(62.66,27.46) 61.02,25.82 v1(61.02,23.91)
  Bottom Layer w0.381: v1(116.14,60.98) 116.14,59.75 115.21,58.82 ; 115.21,58.82 113.43,58.82 110.89,56.28 108.56,56.28 v1(107.71,55.42) ; 115.21,58.82 116.77,57.26 v1(116.77,55.96) ; v1(61.02,23.91) 60.17,23.06 57.4,23.06 56.66,22.32 56.66,10.74 58.96,8.45 58.96,4.84 58.14,4.02 15.29,4.02 15.25,3.99 11.95,3.99 8.76,7.17 8.76,22.42 v1(6.27,24.91) ; v1(62.66,27.46) 64.7,29.5 64.7,41.81 66.22,43.33 73.26,43.33 74.44,44.51 74.44,46.58 76.95,49.09 93.55,49.09 98.65,54.2 98.65,61.91 100.97,64.22 102.64,64.22 103.27,63.6 103.27,61.11 v1(102.31,60.16)
3V7: length 159.6
  Top Layer w0.508: 54.98,106.82 v2(56,106.82)
  Bottom Layer w0.508: v2(56,106.82) 54.38,106.82 53.87,106.31 50.19,106.31 48.28,104.41 22.63,104.41 14.75,96.54 14.75,83.93 16.59,82.1 16.59,61.62 14.88,59.92 14.88,53.19 16.15,51.92 16.15,45.61 18.82,42.94 38.25,42.94 38.93,42.26 v1(38.93,37.31)
  Bottom Layer w0.635: v2(27.95,28.57) v2(28.61,28.57)
  Bottom Layer w0.762: 37.88,34.9 38.93,35.96 v1(38.93,37.31) ; 37.88,34.9 47.72,34.9 48.76,35.94 v1(48.76,37.29) ; 37.88,34.9 29.83,34.9 29.2,34.28 29.2,31.74 28.61,31.15 v2(28.61,28.57)
  vias: v1(28.22,29.23) v1(38.92,36.68) v1(48.75,36.66)
5V5: length 11.6
  Bottom Layer w0.635: v2(39.59,27.6) 39.59,26.87 40.03,26.43 47.01,26.43 48.08,25.36 v2(49.09,25.36) v2(49.8,25.36)
  vias: v2(39.59,26.86)
12V: length 290.3
  Top Layer w0.381: 26.06,22.14 C131.2 ; 26.06,22.14 26.06,20.97 26.45,20.58 U41.1 27.34,20.58 27.96,19.96 27.96,19.28 27.35,18.68 U41.3 ; 26.06,22.14 v1(26.06,23.19)
  Bottom Layer w0.508: v1(17.24,20.5) 16.28,19.53 16.28,16.15 17.58,14.84 v1(17.58,14.28) 17.39,14.08 v1(17.39,13.39)
  Bottom Layer w0.635: 17.46,23.04 v1(17.46,21.36) 17.24,21.14 v1(17.24,20.5) ; v2(30.9,111.1) v2(30.9,111.81) 30.9,112.56 29.98,113.48 29.98,115.22 32.78,118.02 ; 17.48,23.06 17.33,23.2 ; v1(26.06,23.19) 26.95,22.31 26.95,20.59 29.61,17.92 29.61,13.35 30.78,12.18 v2(31.07,12.18) v2(31.78,12.18)
  Bottom Layer w0.889: 21.02,23.2 v2(22.95,25.13) ; 21.02,23.2 17.33,23.2 16,24.53 ; 21.02,23.2 29.81,23.2 v2(31.76,25.15) 34.8,25.15 v2(36.15,23.79)
  Bottom Layer w1.143: v1(38.88,118.25) 60.98,118.25 67.97,111.27 72.28,111.27 75.59,107.97 75.59,105.43 86.38,94.64 86.38,82.53 85.23,81.39 79.69,81.39 78.81,82.27 78.81,87.03 78.26,87.58 76.19,87.58 74.97,88.8 69.42,88.8 69.37,88.75 ; v1(38.88,118.25) 18.18,118.25 15.58,115.65 15.58,101.05 11.83,97.3 11.83,36.85 10.56,35.58 10.56,30.75 12.41,28.9 14.33,28.9 16,27.23 16,24.53 ; v1(38.88,118.25) v1(38.88,117.5) 38.88,116.68 v1(38.87,116.67) ; 69.37,88.75 69.37,88.78 69.36,88.79 ; 69.37,88.75 v1(69.37,83) ; 69.37,88.75 69.36,88.76 ; 69.36,80.16 69.36,82.99
  vias: v1(38.25,118) v1(68.97,88.63) v1(69,86.45) v1(68.99,82.6) v1(69.01,80.25) v1(69.71,88.62) v1(69.74,86.45) v1(69.74,82.59) v1(69.75,80.25) v2(22.37,24.67) v2(31.17,24.69) v2(35.69,24.37)
12VIN: length 35.1
  Top Layer w0.254: R159.2 14.23,119.63 v1(14.75,120.16) ; U46.5 34.13,114.19 v1(33.64,113.7) 33.64,113.46 R151.2 ; R153.2 40.41,112.83 v1(40.41,113.58) R149.2
  Top Layer w1.27: D9.1 31.42,118.2 v1(29.98,119.64) L19.2
  Bottom Layer w0.254: v1(14.75,120.16) 15.52,120.92 28.7,120.92 v1(29.98,119.64)
  Bottom Layer w0.381: v1(40.41,113.58) 40.12,113.3 34.04,113.3 v1(33.64,113.7) 33.93,113.99 v1(33.93,115.97)
-5V5: length 150
  Top Layer w0.254: R143.2 v2(33.08,20.99)
  Top Layer w0.508: 16.19,73.29 14.49,71.59 v1(14.49,71.54) ; v1(7.23,8.51) 9.67,6.07 9.67,4.82 10.97,3.52 47.08,3.52 47.89,4.32 47.89,6.69 v1(48.63,7.44) ; v1(5.23,27.32) 7.51,29.61 8.78,29.61 10.56,31.38 10.56,41.54 v1(14.5,45.48)
  Inner2 w0.254: v2(33.08,20.99) 33.08,16.74 34.94,14.88 v1(40.12,14.88)
  Bottom Layer w0.508: v1(14.5,45.48) 14.5,50.82 13.93,51.39 13.93,60.5 13.78,60.64 13.78,62 14.5,62.71 14.5,71.53 v1(14.49,71.54) ; v1(5.23,27.32) 5.23,23 3.8,21.57 3.8,10.34 5.62,8.51 v1(7.23,8.51)
  Bottom Layer w0.762: 47.93,11.69 47.93,12.65 46.72,13.86 43.54,13.86 42.52,14.88 v1(40.12,14.88) ; 47.93,11.69 47.93,11.69 v1(47.93,11.76) ; 47.93,11.69 48.95,10.66 49.41,10.66 50.12,9.96 50.12,8.95 48.19,7.02 v1(48.19,6.97)
  vias: v1(40.92,14.87) v1(47.94,12.39)
GND: length 478.3
  Top Layer w0.158: 9.44,16.3 9.51,16.3 v1(10.27,15.55) ; R84.2 v1(89.81,119.78) ; R76.2 v1(84.86,108.47) ; R94.2 v1(71.65,119.78) ; v1(84.48,15.53) R59.2 85.11,15.89 85.41,16.19 R58.1 ; R83.2 v1(88.79,109.34) ; 68.98,100.03 70.07,100.03 70.87,100.83 v1(71.09,100.83) ; 67.15,16.45 67.15,15.73 R72.2 v1(66.44,15.53) ; v1(10.1,13.35) 9.86,13.11 9.48,13.11 ; R82.1 v1(88.41,108.47) ; R73.2 v1(65.3,5.22) ; R93.2 v1(70.63,109.47) ; v1(7.87,15.61) 7.87,15.59 8.23,15.23 ; R86.2 v1(66.7,108.47) ; U10.2 40.76,106.85 v1(40.53,107.08) ; R92.1 v1(70.13,108.47) ; U17.2 v1(7.39,32.74)
  Top Layer w0.203: U13.2 7.64,65.3 v1(7.9,65.04) ; 112.54,57.16 112.81,57.16 v1(113.18,56.78) ; 112.54,61.66 112.97,61.66 v1(113.3,61.99) 113.14,62.16 112.54,62.16 ; v1(7.8,80.6) 7.48,80.92 U11.2 ; R12.1 118.39,61.99 v1(118.89,62.5) ; 116.23,50.54 v1(116.86,50.54) ; 2.36,79.76 1.62,79.76 v1(1.61,79.77) ; X1.4 114.49,57.84 v1(114.45,57.8) ; 112.69,64.17 113.04,64.17 113.8,64.93 113.8,65.46 v1(113.81,65.47) ; C13.1 v1(118.51,57.1) ; C8.1 v1(113.43,55.92) ; 2.53,64.13 2.56,64.16 v1(2.56,65.04) ; U16.1 v1(1.67,47.74) ; v1(118.77,59.2) 118.41,59.55 C12.1 116.6,59.55 X1.2 ; v1(10.27,15.55) 9.99,15.27 9.74,15.27 9.71,15.25 8.3,15.25 ; U15.2 v1(7.39,48.91) ; v1(38.35,57.17) 38.33,57.16 37.68,57.16 ; 112.54,59.16 109.71,59.16 107.96,60.91 ; 101.65,63.51 v1(102.38,63.51) 102.52,63.66 U1.35 ; C39.1 86.36,25.94 v1(86.13,26.18) ; U1.51 105.21,55.82 105.83,55.2 C7.1 ; U1.47 v1(102.38,57.66) ; C4.1 v1(101.62,58.94) ; C10.1 115.61,63.75 115.34,64.02 114.19,64.02 113.33,63.16 112.54,63.16 ; U18.1 v1(1.67,31.58)
  Top Layer w0.254: U3.1 102.74,32.38 v1(102.74,32.87) C1.1 ; U38.8 U38.21 ; 20.11,53.71 20.09,53.73 18.97,53.73 ; v1(89.37,88.58) 89.38,88.57 89.38,87.68 ; v1(25.09,11.86) 25.2,11.97 25.73,11.97 ; v1(58.82,18.43) 58.56,18.16 R147.2 ; U49.10 85.39,21.71 U49.33 ; 63.2,67.51 v1(64.38,67.51) ; U40.10 52.48,18.3 ; 52.48,18.3 53.13,17.65 ; 52.48,18.3 U40.11 ; v1(10.69,54.37) 12.86,54.37 13.27,54.78 R124.1 ; 86.39,37.87 v1(86.39,36.64) ; SW1.2 v1(101.85,25.29) ; v1(100.99,45.36) 101.39,44.95 UCN1.14 ; 72.67,102.87 72.18,102.87 71.76,103.29 U52.10 69.72,103.29 U52.33 ; 57.3,62.53 v1(56.12,62.53) ; 90.1,5.12 89.38,5.12 89.05,4.79 88.48,4.79 ; 57.28,57.51 v1(56.1,57.51) ; UCN1.104 78.9,43.81 v1(78.9,44.89) ; U42.21 16.98,42.07 U42.7 ; U42.21 U42.8 ; U42.21 16.33,40.12 U42.10 ; 98.88,81.56 v1(98.88,80.38) ; U52.14 69.22,105.29 ; 69.22,105.29 U52.19 ; 69.22,105.29 U52.33 ; 63.35,65 v1(62.17,65) ; v1(10.94,98.57) 12.32,97.19 R95.1 ; 54.46,28.41 U39.21 52.51,29.06 U39.10 ; 54.46,28.41 U39.7 v2(54.46,31.32) ; 54.46,28.41 55.11,29.06 U39.6 55.11,30.84 v2(55.46,31.19) ; v1(34.69,97.93) 34.5,97.74 C80.1 ; v1(19.71,74.1) L23.4 v1(20.62,74.1) L23.2 21.57,74.1 v1(21.81,73.86) C157.1 ; v1(84.48,15.53) C55.1 83.57,15.8 C31.1 ; 88.89,37.83 v1(88.89,36.61) ; v1(61.21,14.97) 61.2,14.96 61.2,14.52 ; 82.57,19.34 82.95,19.71 U49.14 85.89,19.71 ; C86.1 v1(23.88,60.22) C74.2 23.88,59.7 v1(23.88,59.18) C76.1 ; v1(65.43,106.57) 65.71,106.29 U52.25 ; 67.72,105.29 U52.33 ; 67.72,105.29 U52.22 ; 67.72,105.29 67.22,105.79 U52.26 ; U40.5 55.08,18.3 ; 55.08,18.3 U40.6 ; 55.08,18.3 54.43,17.65 ; UCN1.84 v1(83.89,44.85) ; v1(38.64,93.17) 38.57,93.1 37.48,93.1 ; v2(26.36,24.53) 26.34,24.55 C93.2 ; C38.1 v1(64.41,23.51) ; LED1.1 v1(10.05,124.22) ; 87.39,19.71 U49.33 ; 87.39,19.71 U49.22 87.39,17.17 87.86,16.7 R52.2 ; 87.39,19.71 87.89,19.21 U49.26 ; U49.33 85.89,19.71 ; UCN1.64 v1(88.89,44.85) ; 18.73,11.9 19.39,11.9 19.42,11.93 ; 18.73,11.9 18.73,11.89 ; 18.73,11.9 18.01,11.9 17.92,11.82 17.49,11.82 ; v2(31.91,114.65) 32.53,114.65 32.8,114.92 33.09,114.92 ; 101.39,37.69 v1(101.39,36.47) ; v1(18.56,67.2) 17.61,66.25 C152.1 ; U51.26 85.38,105.79 85.89,105.29 ; 57.2,48.03 55.99,48.03 55.51,47.54 v1(55.51,47.38) ; U43.21 U43.8 ; U43.21 45.57,40.12 ; U43.21 45.57,42.72 U43.6 ; 57.46,75.02 v1(58.64,75.02) ; UCN1.74 v1(86.39,44.85) ; U37.10 25.85,40.12 U37.21 ; 82.71,120.33 v1(82.28,120.76) ; C25.1 v1(118.83,96.41) ; U40.4 54.43,17.65 ; 54.43,17.65 U40.7 ; 54.43,17.65 U40.21 ; v1(68.35,39.13) 68.89,38.59 68.89,37.69 ; U49.25 89.97,18.71 v1(90.32,19.07) ; 69.22,19.71 69.72,19.21 U50.26 ; 69.22,19.71 U50.33 ; 69.22,19.71 U50.22 69.22,17.17 69.76,16.63 R62.2 ; v1(90.59,110.63) C57.1 91.23,112.03 C53.1 91.74,113.17 v1(92.1,113.17) ; R114.2 13.9,58.82 C153.1 14.23,59.08 13.86,59.45 13.61,59.45 13.51,59.55 C71.1 v1(10.56,60.09) ; 97.4,87.36 v1(97.4,88.54) ; U43.11 45.57,40.12 ; 45.57,40.12 U43.10 ; U51.14 87.39,105.29 ; 87.39,105.29 U51.33 ; 87.39,105.29 U51.19 ; 63.31,77.51 v1(64.49,77.51) ; UCN3.23 74.39,85.94 v1(74.32,85.87) ; C16.1 v1(30.12,110) ; U51.33 85.89,105.29 ; U51.33 87.89,103.29 U51.10 ; U50.25 72.06,18.71 v1(72.41,19.07) ; 100.39,87.43 v1(100.39,88.61) ; UCN1.94 v1(81.39,44.85) ; v1(64.69,51.35) 64.69,51.33 64.38,51.02 63.36,51.02 ; U40.2 54.43,16.35 U40.21 ; U50.33 67.72,19.71 ; U50.33 67.22,21.71 U50.10 ; 57.25,46.53 v1(56.07,46.53) ; CN2.1 30.17,105.63 31.17,104.63 C17.1 ; 81.89,87.6 v1(81.89,88.78) ; 57.24,65.02 v1(56.06,65.02) ; v1(24.9,55.04) 24.89,55.03 24.22,55.03 ; 63.32,62.5 v1(62.14,62.5) ; U38.6 35.69,42.75 U38.21 ; 83.26,120.24 83.3,120.28 84.75,120.28 ; 19.1,91.68 19.1,90.98 18.84,90.71 C155.1 ; C120.1 v2(48.47,27.13) ; C41.1 v1(91.97,103.52) ; v1(35.55,110.65) 35.55,111.92 35.97,112.35 U46.8 35.97,114.17 U46.25 ; v1(35.55,110.65) 35.18,110.65 35.16,110.63 ; v1(35.55,110.65) 36.16,110.65 C147.2 v1(36.68,110.63) R156.2 v1(37.72,110.63) R155.1 ; v1(22.69,13.73) 22.51,13.55 22.06,13.55 ; 19.09,60.1 19.06,60.07 18,60.07 ; v1(99.46,45.48) 98.89,44.91 UCN1.24 ; 63.14,75.01 v1(64.32,75.01) ; C87.1 v1(23.75,90.51) C72.2 v1(23.75,91.6) C79.1 ; 27.16,36.57 v2(27.81,36.57) ; C56.1 v1(66.44,15.53) ; v1(38.21,60.72) 37.71,61.22 37.71,61.77 ; 79.38,81.32 v1(79.38,80.14) ; C133.1 v2(18.28,36.57) ; C37.1 v1(91.84,105.28) ; C23.1 v1(118.89,28.97) ; v1(103.4,88.97) 103.4,87.61 103.38,87.6 ; 76.88,87.58 v1(76.88,86.39) ; 36.93,36.57 v2(37.58,36.57) ; R120.1 13.13,85.72 13.74,85.11 v1(13.86,85.11) 14.44,85.11 C69.1 ; 57.25,49.52 v1(56.07,49.52) ; 98.89,87.41 v1(98.89,88.59) ; 21.85,22.31 22.39,22.31 v1(22.66,22.04) ; C34.1 v1(64.77,19.72) 65.97,19.72 U50.14 67.72,19.71 ; 84.4,81.38 v1(84.4,80.2) ; C51.1 v1(81.68,15.28) ; v1(102.45,54.75) C6.2 ; 14.42,53.67 14.42,54.09 13.3,55.2 13.28,55.2 ; C2.1 v1(102.62,66.18) ; 70.46,4.8 70.92,4.8 71.23,5.1 71.88,5.1 ; R47.2 v1(90.27,15.75) C26.2 ; U50.19 67.72,19.71 ; 35.69,40.15 U38.21 ; 35.69,40.15 U38.10 ; 35.69,40.15 35.69,38.98 ; 85.89,19.71 U49.19 ; 83.84,109.25 v1(83.33,109.25) 82.83,109.25 ; 57.36,52.51 v1(56.18,52.51) ; 100.4,81.51 v1(100.4,80.33) ; 72.3,111.42 72.3,111.84 72.76,112.3 ; 84.86,120.29 85.33,120.76 v1(85.35,120.76) ; 94.39,81.5 v1(94.39,80.32) ; U40.21 U40.8 ; U40.21 53.13,17.65 ; 85.89,105.29 U51.22 ; 81.39,37.49 v1(81.39,38.71) ; v1(18.36,75.04) 17.77,75.04 17.29,74.56 L22.4 L22.2 ; 18.04,91.69 19.09,91.69 19.13,91.73 ; 81.9,81.54 81.89,81.53 v1(81.89,80.02) ; 25.92,11.95 26.53,11.95 v1(26.76,11.72) ; 17.34,18.93 17.88,18.93 17.96,19.02 19.23,19.02 19.25,19.04 ; 20.35,15.22 20.41,15.15 21.99,15.15 ; v1(10.56,65.42) 11.45,65.42 12.06,64.81 R96.2 ; 25.11,15.91 25.18,15.84 v1(25.18,15.26) ; v1(31.75,52.83) 31.74,52.83 31.41,53.16 ; 91.89,87.41 v1(91.89,88.59) ; C85.1 v1(23.01,64.2) ; 78.89,37.58 v1(78.89,38.81) ; 57.71,60.03 57.72,60.02 58.23,60.02 58.45,59.79 v1(58.45,59.32) ; v1(94.26,45.1) 93.89,44.74 UCN1.44 ; v1(64.54,53.53) 64.54,52.86 64.21,52.53 63.88,52.53 ; 63.37,60.02 v1(62.19,60.02) ; R106.1 12.06,61.2 11.58,60.72 v1(10.56,60.72) ; 83.93,5.23 v1(83.3,5.23) ; 97.39,81.58 v1(97.39,80.4) ; R136.2 v2(17.34,28.72) ; R137.2 v2(26.11,28.72) ; C158.1 23.16,70.12 v1(22.73,70.12) 21.74,70.12 21.62,70.24 U59.9 ; C33.1 v1(91.1,108.85) ; 63.43,46.52 v1(62.25,46.52) ; v2(37.27,20.99) C108.1 ; C156.1 16.35,70.12 16.35,69.27 v1(15.77,69.27) ; 57.3,51.03 v1(56.11,51.03) ; 63.25,55.02 v1(62.07,55.02) ; C154.1 v1(17.96,97.93) ; 79.38,87.7 v1(79.38,88.88) ; U37.21 26.5,42.07 U37.7 ; U37.21 U37.8 ; C27.2 v1(72.74,16) R48.2 ; 95.9,81.51 v1(95.9,80.33) ; R103.2 12.32,92.95 C68.1 13.56,91.25 13.91,90.9 v1(13.91,89.98) 13.55,89.98 R113.2 ; 57.76,55.03 58.3,55.03 58.52,54.81 v1(58.52,53.96) ; 57.7,72.52 57.7,72.52 v1(59.08,72.52) ; C30.1 v1(64.92,16.53) ; C22.1 118.89,6.11 ; v1(86.91,80.1) 86.91,80.87 86.87,80.9 ; 73.9,43.81 v1(73.9,42.63) ; 57.32,77.53 v1(56.14,77.53) ; 94.39,87.41 v1(94.39,88.59) ; 107.96,60.91 107.71,61.16 U1.25 ; 63.46,45.02 v1(62.28,45.02) ; 57.09,67.53 v1(55.91,67.53) ; 57.14,45.02 v1(55.95,45.02) ; 66.49,120.29 65.2,120.29 ; 46.87,36.57 v2(47.52,36.57) ; 76.38,43.91 v1(76.38,42.73) ; C3.1 v1(106.38,54.75) C7.1 ; 91.89,81.25 v1(91.89,82.43) ; 37.47,112.99 37.47,113.83 ; v1(22.64,20.84) 22.42,20.62 21.85,20.62 ; 98.89,37.83 v1(98.89,36.6) ; R8.1 v1(46.62,122.34) R7.1 v1(47.92,122.34) R6.1 v1(49.17,122.34) R5.1 ; v1(83.46,106.7) 83.87,106.29 U51.25 ; v1(72.79,108.85) 72.81,108.84 C32.1 ; UCN1.34 v1(96.39,44.97) ; 63.27,72.52 v1(64.45,72.52) ; 89.4,81.45 v1(89.4,80.27) ; 53.13,17.65 U40.12 ; 53.13,17.65 U40.9 ; v1(84.6,36.34) 84.32,36.34 83.89,36.77 83.89,37.69 ; 101.89,81.49 v1(101.89,80.31) ; 65.81,109.25 v1(65.29,109.25) 64.79,109.25 ; 91.38,37.88 v1(91.38,36.65) ; R138.2 v2(39.22,30.14) ; 76.4,37.54 v1(76.4,38.76) ; C92.2 v2(17.58,24.65) ; C78.1 v1(23.14,95.52) ; 63.4,57.53 v1(62.22,57.53) ; C94.2 v2(36.15,29.76) ; 33.09,66.71 33.19,66.71 v1(33.49,67.01) ; U34.17 36.87,17.12 U34.10 34.67,17.12 v2(34.48,17.3) ; v1(26.57,96.47) 26.88,96.16 26.88,96.05 ; 56.97,70.03 55.71,70.03 55.4,69.72 v1(55.39,69.72) ; C77.1 v1(23.53,86.48) ; v1(65.25,49.53) 63.56,49.53 63.55,49.52 ; 63.17,48 v1(64.35,48) ; 86.9,87.96 86.9,88.52 86.52,88.9 v1(85.41,88.9) 84.63,88.9 84.41,88.68 84.41,87.88 ; UCN1.54 v1(91.39,44.85) ; U58.48 26.88,64.73 v1(26.44,65.17) ; C52.1 v1(63.77,15.28) ; 96.4,37.87 v1(96.4,36.64) ; 95.9,87.39 v1(95.9,88.57) ; C81.1 v1(31.39,83.84) ; 71.39,37.52 v1(71.39,38.75) ; 20.11,85.13 20.08,85.1 18.91,85.1 ; 76.9,81.34 v1(76.9,80.16) ; UCN1.144 v1(68.89,44.97) ; 74.4,81.35 v1(74.4,80.17) ; C24.1 v1(115.97,75.2) ; 73.07,112.63 v1(73.64,112.63) ; 63.16,70.02 v1(64.35,70.02) ; 93.89,37.84 v1(93.89,36.61) ; C83.1 v1(38.01,88.06) ; 71.39,43.84 v1(71.39,42.65) ; 73.89,37.57 v1(73.89,38.8) ; 101.89,87.45 v1(101.89,88.63)
  Top Layer w0.381: C15.1 v1(4.31,25.78) C14.2 ; v2(50.55,46.88) L17.4 v2(50.55,45.91) L17.2 ; v1(1.56,23.24) L3.2 v1(2.59,23.24) L3.4 v1(3.47,23.24) U5.2 ; 28.67,22.12 28.59,22.21 27.52,22.21 ; 38.41,24.94 38.41,24.22 v2(38.46,24.17) 38.46,23.67 ; 38.41,24.94 38.41,25.98 38.35,26.03 ; 38.41,24.94 38.4,24.95 ; v2(50.43,23.82) L10.2 v2(49.51,23.82) L10.4 v2(48.47,23.82) ; 6.63,11.88 6.95,11.88 v1(7.64,11.19) ; U4.2 v1(118.89,53.67) ; v2(40.68,46.88) L9.4 v2(40.68,45.87) L9.2 ; 21.31,37.48 v2(21.31,36.96) L14.4 v2(21.31,35.96) ; v2(57.58,23.82) 57.99,23.82 L11.4 v2(58.5,23.82) L11.2 v2(59.52,23.82) ; U41.2 v1(25.8,19.63) ; v1(7.56,18.74) 7.01,18.19 6.62,18.19 ; C100.2 v2(31.33,27.47) 31.26,27.39 U32.3 29.86,27.39 U32.9 ; 30.83,37.48 v2(30.83,36.99) L6.4 v2(30.83,35.96) ; 30.82,45.35 v2(30.82,46.88) ; 32.32,16.65 32.32,18.19 ; L15.2 v2(21.31,45.86) L15.4 v2(21.31,46.88) ; 30.42,19.49 29.78,19.49 v1(29.77,19.5) ; 23.13,27.47 v2(22.55,27.47) 22.47,27.4 21.08,27.4 20.75,27.07 ; v2(50.55,35.96) L16.4 v2(50.55,37) 50.55,37.48 ; v2(39.8,16.92) v2(41.34,16.92) ; v2(40.68,35.96) L8.4 v2(40.68,36.99) 40.68,37.48
  Top Layer w0.508: C138.1 v2(52.9,103.15) C137.2 ; 53.04,105.82 v2(56,105.82)
  Bottom Layer w0.158: v1(70.63,109.47) 70.63,109.49
  Bottom Layer w0.203: v1(113.43,55.92) 113.43,55.9 ; v1(1.67,47.74) 1.67,47.77 ; v1(116.86,50.54) 116.99,50.54
  Bottom Layer w0.254: v1(115.97,75.2) 115.97,75.07 ; v1(15.77,69.27) 15.77,69.23 ; v1(85.35,120.76) 85.34,120.76 ; v1(118.83,96.41) 118.89,96.41 ; v1(63.77,15.28) 63.77,15.38 ; v1(25.09,11.86) 25.09,11.85 ; v1(23.01,64.2) 23.01,64.28 ; C19.1 v1(106.95,43.45) ; v1(96.39,44.97) 96.41,44.97 ; v1(81.39,44.85) 81.43,44.85 ; v1(17.96,97.93) 18.06,97.93 ; v1(31.75,52.83) 31.74,52.83 ; v1(83.89,44.85) 83.97,44.85
  Bottom Layer w0.381: C20.1 v1(74.19,83.07) ; C21.1 v1(74.32,85.87)
  vias: v1(14.34,37.86) v1(15.39,63.26) v1(15.63,94.88) v1(15.9,62.75) v1(16.14,94.37) v1(16.5,88.29) v1(16.53,56.91) v1(16.86,87.8) v1(16.87,56.33) v1(19.1,91.47) v1(19.05,59.84) v1(20.12,84.79) v1(20.13,53.47) v1(21,97.78) v1(20.95,66.19) v1(22.02,91.26) v1(22.03,59.86) v1(25.48,17.07) v1(28.04,22.21) v1(28.43,116.53) v1(29.41,116.53) v1(31.98,121.4) v1(32.61,121.4) v1(33.22,121.4) v1(36.45,122.83) v1(36.45,122.21) v1(36.45,121.59) v1(36.47,120.28) v1(36.47,119.67) v1(42.61,111.66) v1(42.61,110.69) v1(65.9,120.31) v1(71.07,4.96) v1(71.9,103.14) v1(85.17,15.97) v1(89.18,4.95) v1(105.15,81.55) v1(105.15,80.79) v1(114.19,63.99) v1(118.89,6.11) v2(12.34,27.18) v2(12.33,26.36) v2(12.34,25.53) v2(12.34,24.64) v2(12.33,23.82) v2(12.34,22.99) v2(12.34,22.14) v2(12.33,21.32) v2(12.34,20.49) v2(12.34,19.6) v2(12.33,18.78) v2(12.34,17.95) v2(12.34,17.16) v2(12.33,16.34) v2(12.34,15.51) v2(12.34,14.62) v2(12.33,13.8) v2(12.34,12.97) v2(12.34,10.52) v2(12.34,9.63) v2(12.33,8.81) v2(12.32,7.94) v2(12.32,7.09) v2(12.32,6.31) v2(13.19,27.18) v2(13.19,26.36) v2(13.19,25.53) v2(13.19,24.64) v2(13.19,23.82) v2(13.19,22.99) v2(13.19,22.14) v2(13.19,21.32) v2(13.19,20.49) v2(13.19,19.6) v2(13.19,18.78) v2(13.19,17.95) v2(13.19,17.16) v2(13.19,16.34) v2(13.19,15.51) v2(13.19,14.62) v2(13.19,13.8) v2(13.19,12.97) v2(13.19,10.52) v2(13.19,9.63) v2(13.19,8.81) v2(13.15,7.95) v2(13.15,7.09) v2(13.15,6.31) v2(13.97,27.18) v2(13.97,26.36) v2(13.97,25.53) v2(13.97,24.64) v2(13.97,23.82) v2(13.97,22.99) v2(13.97,22.14) v2(13.97,21.32) v2(13.97,20.49) v2(13.97,19.6) v2(13.97,18.78) v2(13.97,17.95) v2(13.97,17.16) v2(13.97,16.34) v2(13.97,15.51) v2(13.97,14.62) v2(13.97,13.8) v2(13.97,12.97) v2(13.97,10.52) v2(13.97,9.63) v2(13.97,8.81) v2(13.97,7.94) v2(13.97,7.09) v2(13.97,6.31) v2(14.86,7.94) v2(14.86,7.09) v2(14.86,6.31) v2(15.69,7.95) v2(15.69,7.09) v2(15.69,6.31) v2(16.51,7.94) v2(16.51,7.09) v2(16.51,6.31) v2(16.81,42.24) v2(16.81,41.42) v2(16.81,40.59) v2(17.36,7.94) v2(17.36,7.09) v2(17.36,6.31) v2(17.59,42.24) v2(17.59,41.42) v2(17.59,40.59) v2(17.55,33.88) v2(17.55,33.02) v2(17.55,32.24) v2(18.19,7.95) v2(18.19,7.09) v2(18.19,6.31) v2(18.38,33.88) v2(18.38,33.02) v2(18.38,32.24) v2(18.44,42.24) v2(18.45,41.42) v2(18.44,40.59) v2(19.02,7.94) v2(19.02,7.09) v2(19.02,6.31) v2(19.2,33.88) v2(19.2,33.02) v2(19.2,32.24) v2(19.62,22.18) v2(19.62,21.47) v2(19.58,19.68) v2(19.58,18.96) v2(19.72,12.58) v2(19.72,11.87) v2(19.74,15.1) v2(19.74,14.39) v2(19.9,7.94) v2(19.9,7.09) v2(19.9,6.31) v2(20.62,24.9) v2(20.62,24.19) v2(20.75,27.43) v2(20.75,26.72) v2(20.73,7.95) v2(20.73,7.09) v2(20.73,6.31) v2(20.92,33.88) v2(20.92,33.02) v2(20.92,32.24) v2(21.05,113.93) v2(21.18,29.95) v2(21.18,29.24) v2(21.56,7.94) v2(21.56,7.09) v2(21.56,6.31) v2(21.71,41.42) v2(21.74,33.88) v2(21.74,33.02) v2(21.74,32.24) v2(21.88,113.94) v2(22.39,41.42) v2(22.42,7.94) v2(22.42,7.09) v2(22.42,6.31) v2(22.6,33.88) v2(22.6,33.02) v2(22.6,32.24) v2(22.71,113.93) v2(22.98,19.34) v2(23.1,12.23) v2(23.25,7.95) v2(23.25,7.09) v2(23.25,6.31) v2(23.47,113.93) v2(23.43,33.88) v2(23.43,33.02) v2(23.43,32.24) v2(23.69,19.34) v2(23.81,12.23) v2(24.07,7.94) v2(24.07,7.09) v2(24.07,6.31) v2(24.29,113.94) v2(24.25,33.88) v2(24.25,33.02) v2(24.25,32.24) v2(24.96,7.94) v2(24.96,7.09) v2(24.96,6.31) v2(25.12,113.93) v2(25.14,33.88) v2(25.14,33.02) v2(25.14,32.24) v2(25.34,123.34) v2(25.79,7.95) v2(25.79,7.09) v2(25.79,6.31) v2(25.88,113.93) v2(25.97,33.88) v2(25.97,33.02) v2(25.97,32.24) v2(26.16,123.33) v2(26.33,42.24) v2(26.34,41.42) v2(26.33,40.59) v2(26.61,7.94) v2(26.61,7.09) v2(26.61,6.31) v2(26.71,113.94) v2(26.79,33.88) v2(26.79,33.02) v2(26.79,32.24) v2(26.92,123.33) v2(27.11,42.24) v2(27.12,41.42) v2(27.11,40.59) v2(27.41,7.94) v2(27.41,7.09) v2(27.41,6.31) v2(27.59,33.88) v2(27.59,33.02) v2(27.59,32.24) v2(27.97,42.24) v2(27.97,41.42) v2(27.97,40.59) v2(28.24,7.95) v2(28.24,7.09) v2(28.24,6.31) v2(28.39,33.88) v2(28.39,33.02) v2(28.39,32.24) v2(28.53,93.35) v2(28.53,92.49) v2(28.53,91.71) v2(28.53,90.94) v2(28.53,90.08) v2(28.53,89.3) v2(28.53,61.98) v2(28.53,61.12) v2(28.53,60.34) v2(28.53,59.57) v2(28.53,58.71) v2(28.53,57.93) v2(29.06,7.94) v2(29.06,7.09) v2(29.06,6.31) v2(29.2,111.82) v2(29.2,111.11) v2(29.36,93.35) v2(29.36,92.5) v2(29.36,91.72) v2(29.36,90.94) v2(29.36,90.08) v2(29.36,89.3) v2(29.36,61.99) v2(29.36,61.13) v2(29.36,60.35) v2(29.36,59.57) v2(29.36,58.72) v2(29.36,57.94) v2(29.37,24.98) v2(29.37,24.27) v2(29.54,27.42) v2(29.54,26.71) v2(29.96,29.96) v2(29.96,29.25) v2(29.95,7.94) v2(29.95,7.09) v2(29.95,6.31) v2(30.18,93.35) v2(30.18,92.49) v2(30.18,91.71) v2(30.18,90.94) v2(30.18,90.08) v2(30.18,89.3) v2(30.18,61.98) v2(30.18,61.12) v2(30.18,60.34) v2(30.18,59.57) v2(30.18,58.71) v2(30.18,57.93) v2(30.17,33.88) v2(30.17,33.02) v2(30.17,32.24) v2(30.78,7.95) v2(30.78,7.09) v2(30.78,6.31) v2(30.83,45.86) v2(30.96,33.88) v2(30.96,33.02) v2(30.96,32.24) v2(31.07,93.35) v2(31.07,92.49) v2(31.07,91.71) v2(31.07,90.94) v2(31.07,90.08) v2(31.07,89.3) v2(31.07,61.98) v2(31.07,61.12) v2(31.07,60.34) v2(31.07,59.57) v2(31.07,58.71) v2(31.07,57.93) v2(31.2,114.65) v2(31.24,41.42) v2(31.41,13.72) v2(31.6,7.94) v2(31.6,7.09) v2(31.6,6.31) v2(31.78,33.88) v2(31.78,33.02) v2(31.78,32.24) v2(31.9,93.35) v2(31.9,92.5) v2(31.9,91.72) v2(31.9,90.94) v2(31.9,90.08) v2(31.9,89.3) v2(31.9,61.99) v2(31.9,61.13) v2(31.9,60.35) v2(31.9,59.57) v2(31.9,58.72) v2(31.9,57.94) v2(31.92,41.42) v2(32.21,123.13) v2(32.32,17.3) v2(32.39,7.94) v2(32.39,7.09) v2(32.39,6.31) v2(32.57,33.88) v2(32.57,33.02) v2(32.57,32.24) v2(32.68,13.46) v2(32.72,93.35) v2(32.72,92.49) v2(32.72,91.71) v2(32.72,90.94) v2(32.72,90.08) v2(32.72,89.3) v2(32.72,61.98) v2(32.72,61.12) v2(32.72,60.34) v2(32.72,59.57) v2(32.72,58.71) v2(33.04,123.14) v2(33.22,7.95) v2(33.22,7.09) v2(33.22,6.31) v2(33.4,33.88) v2(33.4,33.02) v2(33.4,32.24) v2(34.04,7.94) v2(34.04,7.09) v2(34.04,6.31) v2(34.23,33.88) v2(34.23,33.02) v2(34.23,32.24) v2(34.29,12.14) v2(34.94,12.13) v2(34.94,11.35) v2(34.93,7.94) v2(34.93,7.09) v2(34.93,6.31) v2(35.11,33.88) v2(35.11,33.02) v2(35.11,32.24) v2(35.14,26.2) v2(35.76,7.95) v2(35.76,7.09) v2(35.76,6.31) v2(35.9,115.74) v2(35.9,114.88) v2(35.9,114.1) v2(35.85,26.2) v2(35.94,33.88) v2(35.94,33.02) v2(35.94,32.24) v2(36.17,42.27) v2(36.18,41.45) v2(36.17,40.62) v2(36.58,7.94) v2(36.58,7.09) v2(36.58,6.31) v2(36.73,115.74) v2(36.73,114.89) v2(36.73,114.11) v2(36.77,33.88) v2(36.77,33.02) v2(36.77,32.24) v2(36.74,17.25) v2(36.74,16.49) v2(36.95,42.27) v2(36.96,41.45) v2(36.95,40.62) v2(37.5,17.25) v2(37.5,16.49) v2(37.43,7.94) v2(37.43,7.09) v2(37.43,6.31) v2(37.55,115.74) v2(37.55,114.88) v2(37.55,114.1) v2(37.61,33.88) v2(37.61,33.02) v2(37.61,32.24) v2(37.81,42.27) v2(37.81,41.45) v2(37.81,40.62) v2(37.73,26) v2(38.26,7.95) v2(38.26,7.09) v2(38.26,6.31) v2(38.44,33.88) v2(38.44,33.02) v2(38.44,32.24) v2(38.44,26) v2(39.08,7.94) v2(39.08,7.09) v2(39.08,6.31) v2(39.26,33.88) v2(39.26,33.02) v2(39.26,32.24) v2(39.97,7.94) v2(39.97,7.09) v2(39.97,6.31) v2(40.15,33.88) v2(40.15,33.02) v2(40.15,32.24) v2(40.37,25.67) v2(40.8,7.95) v2(40.8,7.09) v2(40.8,6.31) v2(40.98,33.88) v2(40.98,33.02) v2(40.98,32.24) v2(41.07,41.43) v2(41.08,25.67) v2(41.62,7.94) v2(41.62,7.09) v2(41.62,6.31) v2(41.75,41.43) v2(41.8,33.88) v2(41.8,33.02) v2(41.8,32.24) v2(42.61,33.88) v2(42.61,33.02) v2(42.61,32.24) v2(43.44,33.88) v2(43.44,33.02) v2(43.44,32.24) v2(44.21,31.42) v2(44.22,30.59) v2(44.22,29.7) v2(44.21,28.88) v2(44.22,28.05) v2(44.22,27.25) v2(44.21,25.54) v2(44.22,24.71) v2(44.21,23.88) v2(44.22,23.05) v2(44.22,22.21) v2(44.21,21.38) v2(44.22,20.56) v2(44.22,19.67) v2(44.22,18.02) v2(44.21,16.4) v2(44.22,15.57) v2(44.22,14.69) v2(44.22,13.03) v2(44.22,12.24) v2(44.21,11.41) v2(44.26,33.88) v2(44.26,33.02) v2(44.26,32.24) v2(45.07,31.42) v2(45.07,30.59) v2(45.07,29.7) v2(45.07,28.88) v2(45.07,28.05) v2(45.07,27.25) v2(45.07,25.54) v2(45.07,24.71) v2(45.07,23.88) v2(45.07,23.05) v2(45.07,22.21) v2(45.07,21.38) v2(45.07,20.56) v2(45.07,19.67) v2(45.07,18.02) v2(45.07,16.4) v2(45.07,15.57) v2(45.07,14.69) v2(45.07,13.03) v2(45.07,12.24) v2(45.07,11.41) v2(45.15,33.88) v2(45.15,33.02) v2(45.15,32.24) v2(45.85,31.42) v2(45.85,30.59) v2(45.85,29.7) v2(45.85,28.88) v2(45.85,28.05) v2(45.85,27.25) v2(45.85,25.54) v2(45.85,24.71) v2(45.85,23.88) v2(45.85,23.05) v2(45.85,22.21) v2(45.85,21.38) v2(45.85,20.56) v2(45.85,19.67) v2(45.85,18.02) v2(45.85,16.4) v2(45.85,15.57) v2(45.85,14.69) v2(45.85,13.03) v2(45.85,12.24) v2(45.85,11.41) v2(45.98,33.88) v2(45.98,33.02) v2(45.98,32.24) v2(46.05,42.24) v2(46.05,41.42) v2(46.05,40.59) v2(46.83,42.24) v2(46.83,41.42) v2(46.83,40.59) v2(47.68,42.24) v2(47.69,41.42) v2(47.68,40.59) v2(49.32,13.97) v2(49.35,13.26) v2(49.72,12.04) v2(50.96,41.42) v2(51.64,41.42) v2(52.95,17.82) v2(52.95,17.04) v2(52.95,16.19) v2(53.27,13.19) v2(53.34,24.26) v2(53.8,28.58) v2(53.8,27.8) v2(53.8,26.94) v2(53.78,17.82) v2(53.78,17.04) v2(53.78,16.18) v2(53.9,13.19) v2(54,23.38) v2(54.01,22.74) v2(54.31,24.26) v2(54.41,12.41) v2(54.41,11.8) v2(54.6,17.82) v2(54.6,17.04) v2(54.6,16.19) v2(54.54,13.19) v2(54.63,28.58) v2(54.63,27.8) v2(54.63,26.95) v2(58.2,27.67) v2(58.91,27.67) v2(59.18,14.52) v2(59.18,13.92) v2(59.41,84.14) v2(59.42,83.31) v2(59.41,42.24) v2(59.42,41.41) v2(60.08,13.17) v2(60.19,84.14) v2(60.2,83.31) v2(60.19,42.24) v2(60.2,41.41) v2(60.13,12.05) v2(61.05,84.14) v2(61.05,83.31) v2(61.05,42.24) v2(61.05,41.41) v2(65.28,85.28) v2(65.28,84.42) v2(65.28,83.64) v2(65.28,41.56) v2(65.28,40.7) v2(65.28,39.92) v2(66.11,85.28) v2(66.11,84.42) v2(66.11,83.64) v2(66.11,41.56) v2(66.11,40.71) v2(66.11,39.93) v2(67.2,105.74) v2(67.2,104.96) v2(67.2,104.11) v2(67.2,103.33) v2(67.2,21.67) v2(67.2,20.89) v2(67.2,20.03) v2(67.2,19.25) v2(68.09,105.74) v2(68.09,104.96) v2(68.09,104.11) v2(68.09,103.33) v2(68.09,21.67) v2(68.09,20.89) v2(68.09,20.03) v2(68.09,19.25) v2(68.92,105.75) v2(68.92,104.97) v2(68.92,104.11) v2(68.92,103.33) v2(68.92,21.67) v2(68.92,20.9) v2(68.92,20.04) v2(68.92,19.26) v2(69.74,105.74) v2(69.74,104.96) v2(69.74,104.11) v2(69.74,103.33) v2(69.74,21.67) v2(69.74,20.89) v2(69.74,20.03) v2(69.74,19.25) v2(85.36,105.74) v2(85.36,104.96) v2(85.36,104.11) v2(85.36,103.33) v2(85.36,21.67) v2(85.36,20.89) v2(85.36,20.03) v2(85.36,19.25) v2(86.25,105.74) v2(86.25,104.96) v2(86.25,104.11) v2(86.25,103.33) v2(86.25,21.67) v2(86.25,20.89) v2(86.25,20.03) v2(86.25,19.25) v2(87.08,105.75) v2(87.08,104.97) v2(87.08,104.11) v2(87.08,103.33) v2(87.08,21.67) v2(87.08,20.9) v2(87.08,20.04) v2(87.08,19.26) v2(87.91,105.74) v2(87.91,104.96) v2(87.91,104.11) v2(87.91,103.33) v2(87.91,21.67) v2(87.91,20.89) v2(87.91,20.03) v2(87.91,19.25) v2(107.13,61.68) v2(107.13,60.9) v2(107.13,60.13) v2(107.18,41.56) v2(107.18,40.7) v2(107.18,39.92) v2(107.56,85.28) v2(107.56,84.42) v2(107.96,61.69) v2(107.96,60.91) v2(107.96,60.13) v2(108.01,41.56) v2(108.01,40.71) v2(108.01,39.93) v2(108.1,83.2) v2(108.79,61.68) v2(108.79,60.9) v2(108.79,60.13)
